# EasyEDA Pro project Cortex-8 (1).epro, board PCB2
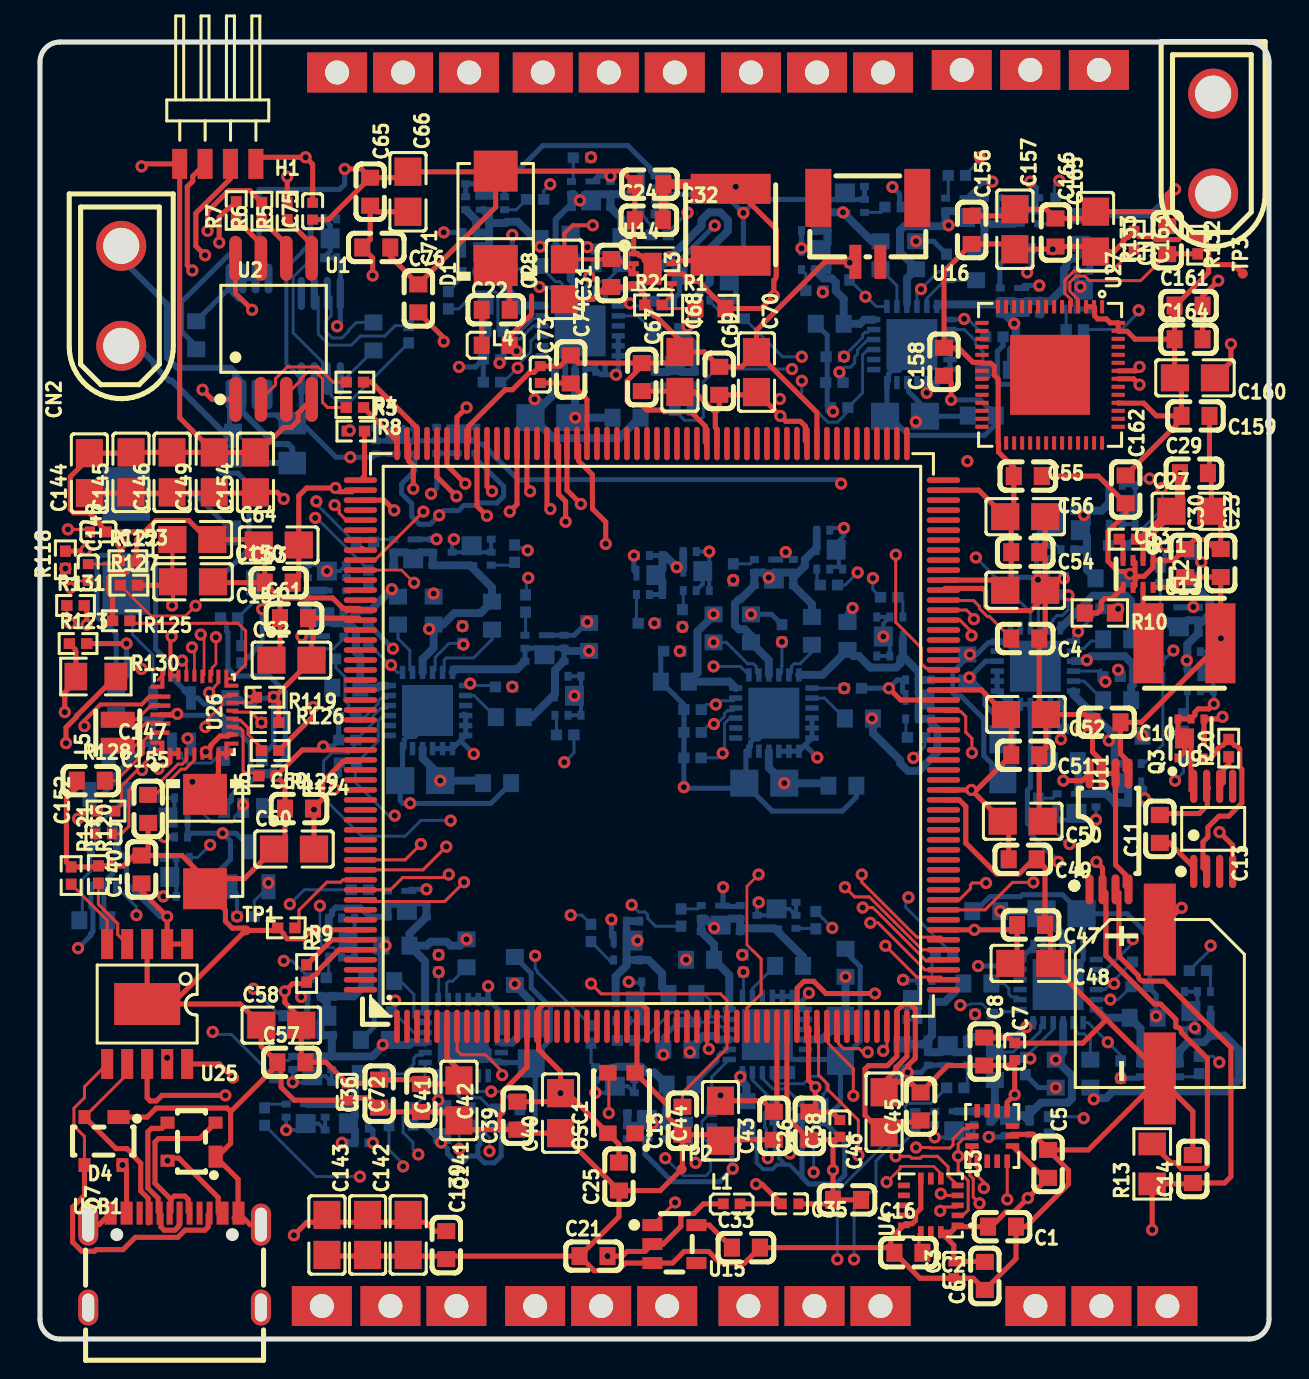
[diagram p0: board, top side]
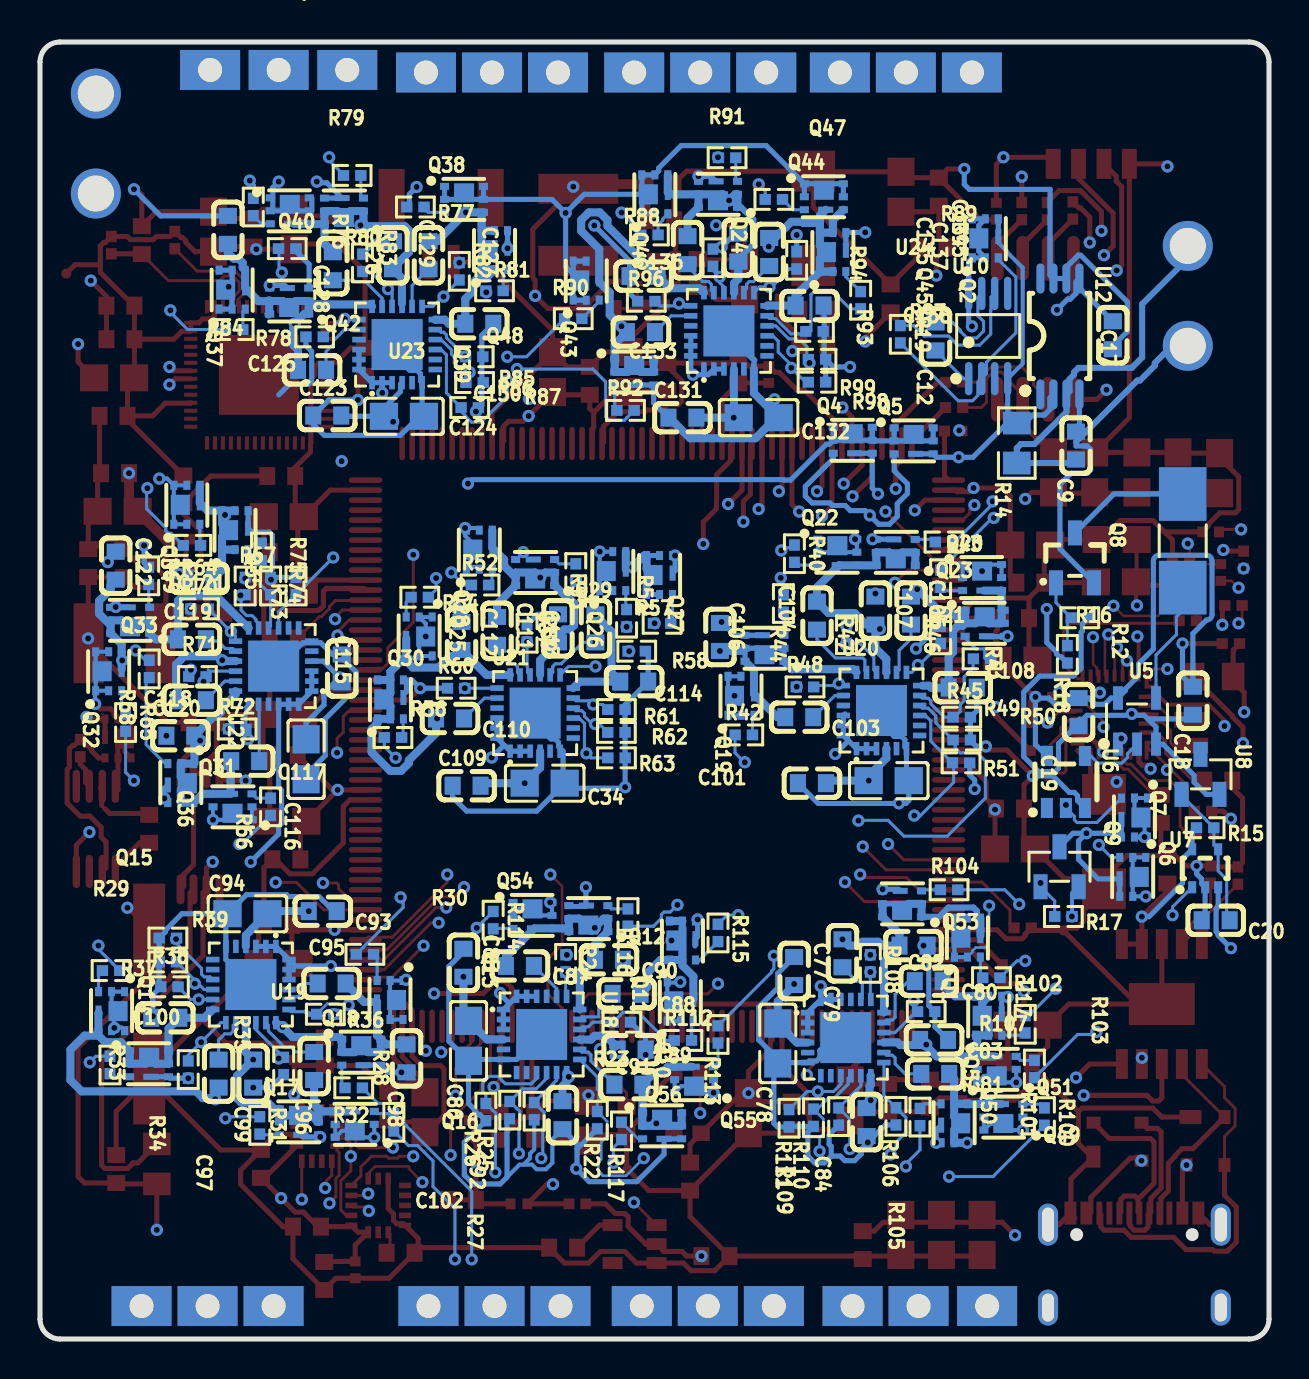
[diagram p1: board, bottom side, seen from below]

Outline 61.47 x 64.9 mm; copper layers: Top Layer, Inner1, Inner2, Inner3, Inner4, Inner5, Inner6, Bottom Layer. Coordinates in mm from the lower left corner of the outline.
Outline path: 0,63.9 0,1 arc(0.29,0.29) 1,0 60.47,0 arc(61.18,0.29) 61.47,1 61.47,63.9 arc(61.18,64.6) 60.47,64.9 1,64.9 arc(0.29,64.6) 0,63.9
Stack: Top Layer 0.035mm Outer layer thickness 1oz / Dielectric1 0.1164mm 2116 RC54% 4.9mil / Inner1 0.0152mm Inner layer thickness / Dielectric2 0.3mm 0.3mm H/HOZ No copper / Inner2 0.0152mm Inner layer thickness / Dielectric3 0.0764mm 1080 RC67% 3.3mil / Dielectric4 0.0764mm 1080 RC67% 3.3mil / Inner3 0.0152mm Inner layer thickness / Dielectric5 0.3mm 0.3mm H/HOZ No copper / Inner4 0.0152mm Inner layer thickness / Dielectric6 0.0764mm 1080 RC67% 3.3mil / Dielectric7 0.0764mm 1080 RC67% 3.3mil / Inner5 0.0152mm Inner layer thickness / Dielectric8 0.3mm 0.3mm H/HOZ No copper / Inner6 0.0152mm Inner layer thickness / Dielectric9 0.1164mm 2116 RC54% 4.9mil / Bottom Layer 0.035mm Outer layer thickness 1oz

## Design rules (mm)
spacing copperThickness1oz (default): track to track 0.102, other pairs 0.152 to 0.3
spacing copperThickness2oz: track to track 0.203, other pairs 0.152 to 0.3
track width copperThickness1oz (default): min 0.127, default 0.254, max 2.54
track width copperThickness2oz: min 0.203, default 0.254, max 2.54
differential pair differentialPair (default): width min 0.127, default 0.254, max 2.54; gap min 0.152, default 0.152
net DGND uses copperRegion

## Placement (name value [footprint] x y rotation side)
C1  100nF  [C0603]  48.11 5.62 180 top
C2  100nF  [C0603]  43.43 4.32 180 top
C3  1uF  [C0402]  45.7 3.46 90 top
C4  2.2uF  [C0603]  49.28 35.05 180 top
C5  100nF  [C0603]  50.42 8.76 270 top
C6  100nF  [C0603]  47.26 3.16 90 top
C7  1uF  [C0402]  48.75 14.38 270 top
C8  100nF  [C0603]  47.23 14.38 270 top
C9  100nF  [C0603]  9.65 44.7 90 bottom
C10  100nF  [C0603]  53.34 30.86 180 top
C11  2.2uF  [C0603]  56.01 25.53 90 top
C12  2.2uF  [C0603]  16.68 50.16 90 bottom
C13  220uF  [CAP-SMD_BD8.0-L8.3-W8.3-LS9.3-FD]  56.01 16.76 270 top
C14  100nF  [C0603]  57.66 8.51 90 top
C15  100nF  [C0603]  32.13 10.92 90 top
C16  100nF  [C0603]  40.36 6.96 180 top
C17  100nF  [C0603]  7.81 50.23 270 bottom
C18  100nF  [C0603]  3.81 31.94 90 bottom
C19  100nF  [C0603]  9.53 31.37 90 bottom
C20  100nF  [C0603]  2.67 20.95 0 bottom
C21  100nF  [C0603]  27.69 4.15 0 top
C22  47uF  [C0603]  22.79 51.5 180 top
C23  100nF  [C0603]  59.05 38.83 270 top
C24  47uF  [C0603]  30.45 55.98 0 top
C25  100nF  [C0603]  28.96 8.13 90 top
C26  100nF  [C0603]  38.48 10.67 90 top
C27  10uF  [C0805]  57.59 41.42 0 top
C28  10uF  [C0805]  26.23 53.02 90 top
C29  100nF  [C0603]  57.71 43.32 0 top
C30  100nF  [C0603]  57.27 38.83 270 top
C31  100nF  [C0603]  28.58 53.34 90 top
C32  100nF  [C0603]  30.48 57.78 180 top
C33  100nF  [C0603]  35.31 4.57 0 top
C34  10uF  [C0805]  36.23 27.81 0 bottom
C35  1uF  [C0402]  37.51 6.76 180 top
C36  1uF  [C0402]  15.36 12.37 90 top
C37  100nF  [C0603]  33.69 35.56 270 bottom
C38  1uF  [C0402]  40.01 10.54 90 top
C39  100nF  [C0603]  23.88 11.18 90 top
C40  10uF  [C0805]  26.04 11.3 90 top
C41  100nF  [C0603]  19.05 12.06 90 top
C42  10uF  [C0805]  20.95 11.94 90 top
C43  100nF  [C0603]  36.7 10.67 90 top
C44  10uF  [C0805]  34.04 10.92 90 top
C45  100nF  [C0603]  44.04 11.63 90 top
C46  10uF  [C0805]  42.22 11.35 90 top
C47  100nF  [C0603]  49.57 20.72 180 top
C48  10uF  [C0805]  49.53 18.8 180 top
C49  100nF  [C0603]  49.15 24 180 top
C50  10uF  [C0805]  49.15 25.91 180 top
C51  100nF  [C0603]  49.28 29.21 180 top
C52  10uF  [C0805]  49.31 31.25 180 top
C53  100nF  [C0603]  49.28 39.37 180 top
C54  10uF  [C0805]  49.28 37.46 180 top
C55  100nF  [C0603]  49.4 43.18 180 top
C56  10uF  [C0805]  49.28 41.15 180 top
C57  100nF  [C0603]  12.57 13.84 0 top
C58  10uF  [C0805]  12.07 15.7 0 top
C59  100nF  [C0603]  12.95 26.54 0 top
C60  10uF  [C0805]  12.7 24.52 0 top
C61  100nF  [C0603]  12.7 36.07 0 top
C62  10uF  [C0805]  12.58 33.97 0 top
C63  100nF  [C0603]  11.94 37.85 0 top
C64  10uF  [C0805]  11.94 39.73 0 top
C65  100nF  [C0603]  16.51 57.41 270 top
C66  10uF  [C0805]  18.4 57.4 270 top
C67  100nF  [C0603]  30.1 48.13 270 top
C68  10uF  [C0805]  32 48.39 270 top
C69  100nF  [C0603]  33.97 47.94 270 top
C70  10uF  [C0805]  35.83 48.38 270 top
C71  2.2uF  [C0603]  18.92 52.07 270 top
C72  100nF  [C0603]  16.96 12.28 90 top
C73  1uF  [C0402]  25.02 48.26 270 top
C74  100nF  [C0603]  26.54 48.51 270 top
C75  1uF  [C0402]  13.64 56.43 90 top
C76  100nF  [C0603]  16.82 54.62 180 top
C77  100nF  [C0603]  23.75 18.41 270 bottom
C78  10uF  [C0805]  24.57 14.79 90 bottom
C79  100nF  [C0603]  21.33 19.3 90 bottom
C80  100nF  [C0603]  17.02 17.91 0 bottom
C81  100nF  [C0603]  16.7 13.27 0 bottom
C82  10nF  [C0603]  17.78 19.68 0 bottom
C83  10nF  [C0603]  16.75 14.97 0 bottom
C84  10nF  [C0603]  20.12 10.86 90 bottom
C85  100nF  [C0603]  40.29 18.83 270 bottom
C86  10uF  [C0805]  40.04 14.92 90 bottom
C87  100nF  [C0603]  37.46 18.67 0 bottom
C88  100nF  [C0603]  32.13 17.27 0 bottom
C89  100nF  [C0603]  32.04 12.73 0 bottom
C90  10nF  [C0603]  33.01 18.98 0 bottom
C91  10nF  [C0603]  31.88 14.48 0 bottom
C92  10nF  [C0603]  35.34 11.2 90 bottom
C93  100nF  [C0603]  47.33 21.41 0 bottom
C94  10uF  [C0805]  51.09 21.28 180 bottom
C95  100nF  [C0603]  46.88 17.79 180 bottom
C96  100nF  [C0603]  47.76 13.66 90 bottom
C97  100nF  [C0603]  52.53 13.28 90 bottom
C98  10nF  [C0603]  43.14 14.04 90 bottom
C99  10nF  [C0603]  50.8 13.28 90 bottom
C100  10nF  [C0603]  55.2 16.07 180 bottom
C101  100nF  [C0603]  22.86 27.81 180 bottom
C102  10uF  [C0805]  19.02 27.94 0 bottom
C103  100nF  [C0603]  23.49 31.11 0 bottom
C104  100nF  [C0603]  22.61 36.19 270 bottom
C105  100nF  [C0603]  17.91 36.45 270 bottom
C106  10nF  [C0603]  27.46 35.13 270 bottom
C107  10nF  [C0603]  19.69 36.45 270 bottom
C108  10nF  [C0603]  15.32 32.59 0 bottom
C109  100nF  [C0603]  40.13 27.69 180 bottom
C110  100nF  [C0603]  40.96 31.05 0 bottom
C111  100nF  [C0603]  38.61 35.43 270 bottom
C112  10nF  [C0603]  40.39 35.18 270 bottom
C113  10nF  [C0603]  35.56 35.56 270 bottom
C114  10nF  [C0603]  31.75 32.89 0 bottom
C115  100nF  [C0603]  46.38 33.55 270 bottom
C116  10uF  [C0805]  48.16 29.01 90 bottom
C117  100nF  [C0603]  51.2 28.92 0 bottom
C118  100nF  [C0603]  53.87 31.96 180 bottom
C119  100nF  [C0603]  53.87 35.01 180 bottom
C120  10nF  [C0603]  54.45 30.19 180 bottom
C121  10nF  [C0603]  53.49 38.06 180 bottom
C122  10nF  [C0603]  57.68 38.69 270 bottom
C123  100nF  [C0603]  47.1 46.21 180 bottom
C124  10uF  [C0805]  43.27 46.17 0 bottom
C125  100nF  [C0603]  47.86 48.49 0 bottom
C126  100nF  [C0603]  46.82 53.68 270 bottom
C127  100nF  [C0603]  42.04 54.23 270 bottom
C128  10nF  [C0603]  52.07 55.5 270 bottom
C129  10nF  [C0603]  43.82 54.23 270 bottom
C130  10nF  [C0603]  39.5 50.8 0 bottom
C131  100nF  [C0603]  29.34 46.1 180 bottom
C132  10uF  [C0805]  25.53 46.1 0 bottom
C133  100nF  [C0603]  31.41 50.38 0 bottom
C134  100nF  [C0603]  29.08 54.48 270 bottom
C135  100nF  [C0603]  25 54.39 270 bottom
C136  10nF  [C0603]  31.28 53.19 180 bottom
C137  10nF  [C0603]  26.54 54.61 270 bottom
C138  10nF  [C0603]  22.98 51.71 0 bottom
C139  100nF  [C0603]  20.32 4.7 270 top
C140  100nF  [C0603]  5.08 23.49 90 top
C141  10uF  [C0805]  18.42 5.21 270 top
C142  10uF  [C0805]  16.38 5.21 270 top
C143  10uF  [C0805]  14.35 5.21 270 top
C144  10uF  [C0805]  2.47 43.33 90 top
C145  10uF  [C0805]  4.55 43.36 90 top
C146  10uF  [C0805]  6.61 43.36 90 top
C147  47nF  [C0402]  3.17 25.27 180 top
C148  47nF  [C0402]  2.41 38.35 270 top
C149  10uF  [C0805]  8.72 43.36 90 top
C150  10uF  [C0805]  7.62 40 180 top
C151  10uF  [C0805]  7.65 37.89 180 top
C152  4.7uF  [C0603]  5.41 26.53 90 top
C153  47nF  [C0402]  2.92 40.39 180 top
C154  10uF  [C0805]  10.78 43.36 90 top
C155  2.2uF  [C0603]  2.54 27.94 180 top
C156  100nF  [C0603]  46.6 55.49 270 top
C157  10uF  [C0805]  48.76 55.53 270 top
C158  100nF  [C0603]  45.21 48.89 90 top
C159  100nF  [C0603]  57.79 46.19 180 top
C160  10uF  [C0805]  57.77 48.09 180 top
C161  100nF  [C0603]  57.44 51.71 0 top
C162  100nF  [C0603]  54.3 42.51 270 top
C163  100nF  [C0603]  56.38 54.99 90 top
C164  100nF  [C0603]  57.44 50.03 0 top
C165  10uF  [C0805]  52.79 55.41 270 top
C166  100nF  [C0603]  50.79 55.37 270 top
CN1  XT30UPB-M  [CONN-TH_XT30UPB-M]  58.67 59.82 90 top
CN2  XT30UPB-M  [CONN-TH_XT30UPB-M]  4.06 52.2 90 top
D1  SMBJ15A  [SMB_L4.6-W3.6-LS5.3-RD]  22.79 56.07 90 top
D4  PRTR5V0U2X  [SOT-143_L2.9-W1.3-P1.92-LS2.3-BL]  3.17 9.91 180 top
D6  SMBJ24A  [SMB_L4.5-W3.7-LS5.4-RD]  8.25 24.89 270 top
D7  PRTR5V0U2X  [SOT-143_L2.9-W1.3-P1.92-LS2.3-BL]  7.58 9.87 90 top
H1  HX PZ1.27-1x4P WT  [HDR-SMD_4P-P1.27-H-M-W7.8]  8.89 58.8 180 top
L1  SCBW100505U100T  [L0402]  34.59 6.76 0 top
L2  2.2uH  [IND-SMD_L4.0-W4.0_LQH44PN2R2MP0L]  57.24 34.81 0 top
L3  2.2uH  [IND-SMD_L4.0-W4.0_LQH44PN2R2MP0L]  34.54 55.75 90 top
L4  4.7uH  [L0603]  22.79 49.72 180 top
L5  1uH  [IND-SMD_L2.0-W1.6_MTQH201610S]  3.89 30.34 90 top
NOREF  -  [Pad_e101]  46.1 63.5 180 top
NOREF#2  -  [Pad_e100]  49.53 63.5 180 top
NOREF#3  -  [Pad_e43]  20.83 1.65 0 top
NOREF#4  -  [Pad_e48]  31.37 1.65 0 top
NOREF#5  -  [Pad_e50]  28.45 63.37 180 top
NOREF#6  -  [Pad_e40]  56.39 1.65 0 top
NOREF#7  -  [Pad_e47]  28.07 1.65 0 top
NOREF#8  -  [Pad_e38]  38.73 1.65 180 top
NOREF#9  -  [Pad_e439]  42.04 1.65 180 top
NOREF#10  -  [Pad_e46]  24.77 1.65 0 top
NOREF#11  -  [Pad_e51]  25.15 63.37 180 top
NOREF#12  -  [Pad_e45]  14.1 1.65 0 top
NOREF#13  -  [Pad_e55]  14.86 63.37 180 top
NOREF#14  -  [Pad_e56]  18.16 63.37 180 top
NOREF#15  -  [Pad_e44]  17.53 1.65 0 top
NOREF#16  -  [Pad_e39]  35.43 1.65 180 top
NOREF#17  -  [Pad_e99]  52.96 63.5 180 top
NOREF#18  -  [Pad_e42]  49.78 1.65 0 top
NOREF#19  -  [Pad_e57]  21.46 63.37 180 top
NOREF#20  -  [Pad_e41]  53.09 1.65 0 top
NOREF#21  -  [Pad_e49]  31.75 63.37 180 top
NOREF#22  -  [Pad_e54]  42.16 63.37 180 top
NOREF#23  -  [Pad_e52]  35.56 63.37 180 top
NOREF#24  -  [Pad_e53]  38.86 63.37 180 top
OSC1  16MHz  [OSC-SMD_4P-L3.2-W2.5_OW2EL89CANUNFAYLC]  29.08 11.81 90 top
Q1  CSD17313Q2  [WSON-6_L2.0-W2.0-P0.65-TL_CSD17313Q2]  15.08 20.09 90 bottom
Q2  CSD17313Q2  [WSON-6_L2.0-W2.0-P0.65-TL_CSD17313Q2]  14.19 55.07 90 bottom
Q3  CSD17313Q2  [WSON-6_L2.0-W2.0-P0.65-TL_CSD17313Q2]  57.57 30.05 90 top
Q4  CSD17313Q2  [WSON-6_L2.0-W2.0-P0.65-TL_CSD17313Q2]  20.82 44.97 180 bottom
Q5  CSD17313Q2  [WSON-6_L2.0-W2.0-P0.65-TL_CSD17313Q2]  17.77 44.94 180 bottom
Q6  CSD17313Q2  [WSON-6_L2.0-W2.0-P0.65-TL_CSD17313Q2]  6.82 23.12 270 bottom
Q7  CSD17313Q2  [WSON-6_L2.0-W2.0-P0.65-TL_CSD17313Q2]  6.73 26.1 270 bottom
Q8  2N7002  [SOT-23-3_L2.9-W1.5-P1.90-LS2.6-BR]  9.7 39.08 270 bottom
Q9  SI2323DS(UMW)  [SOT-23-3_L2.9-W1.3-P0.95-LS2.4-BR]  10.48 23.63 270 bottom
Q10  CSD17313Q2  [WSON-6_L2.0-W2.0-P0.65-TL_CSD17313Q2]  29.44 16.89 90 bottom
Q11  CSD17313Q2  [WSON-6_L2.0-W2.0-P0.65-TL_CSD17313Q2]  29.34 19.94 90 bottom
Q12  CSD17313Q2  [WSON-6_L2.0-W2.0-P0.65-TL_CSD17313Q2]  34.04 21.04 0 bottom
Q13  CSD17313Q2  [WSON-6_L2.0-W2.0-P0.65-TL_CSD17313Q2]  43.96 16.96 270 bottom
Q14  CSD17313Q2  [WSON-6_L2.0-W2.0-P0.65-TL_CSD17313Q2]  57.89 16.4 270 bottom
Q15  CSD17313Q2  [WSON-6_L2.0-W2.0-P0.65-TL_CSD17313Q2]  56.01 13.77 180 bottom
Q16  CSD17313Q2  [WSON-6_L2.0-W2.0-P0.65-TL_CSD17313Q2]  45.72 10.74 0 bottom
Q17  CSD17313Q2  [WSON-6_L2.0-W2.0-P0.65-TL_CSD17313Q2]  48.52 10.87 180 bottom
Q18  CSD17313Q2  [WSON-6_L2.0-W2.0-P0.65-TL_CSD17313Q2]  45.4 14.35 180 bottom
Q19  CSD17313Q2  [WSON-6_L2.0-W2.0-P0.65-TL_CSD17313Q2]  26.41 32.19 90 bottom
Q20  CSD17313Q2  [WSON-6_L2.0-W2.0-P0.65-TL_CSD17313Q2]  14.35 38.1 180 bottom
Q21  CSD17313Q2  [WSON-6_L2.0-W2.0-P0.65-TL_CSD17313Q2]  14.22 35.81 180 bottom
Q22  CSD17313Q2  [WSON-6_L2.0-W2.0-P0.65-TL_CSD17313Q2]  21.59 39.37 180 bottom
Q23  CSD17313Q2  [WSON-6_L2.0-W2.0-P0.65-TL_CSD17313Q2]  18.67 39.36 0 bottom
Q24  CSD17313Q2  [WSON-6_L2.0-W2.0-P0.65-TL_CSD17313Q2]  25.23 34.56 0 bottom
Q25  CSD17313Q2  [WSON-6_L2.0-W2.0-P0.65-TL_CSD17313Q2]  42.5 35.15 270 bottom
Q26  CSD17313Q2  [WSON-6_L2.0-W2.0-P0.65-TL_CSD17313Q2]  32.82 38.42 90 bottom
Q27  CSD17313Q2  [WSON-6_L2.0-W2.0-P0.65-TL_CSD17313Q2]  30.48 38.23 90 bottom
Q28  CSD17313Q2  [WSON-6_L2.0-W2.0-P0.65-TL_CSD17313Q2]  39.5 39.5 90 bottom
Q29  CSD17313Q2  [WSON-6_L2.0-W2.0-P0.65-TL_CSD17313Q2]  36.7 38.35 0 bottom
Q30  CSD17313Q2  [WSON-6_L2.0-W2.0-P0.65-TL_CSD17313Q2]  43.94 32 90 bottom
Q31  CSD17313Q2  [WSON-6_L2.0-W2.0-P0.65-TL_CSD17313Q2]  51.84 26.63 0 bottom
Q32  CSD17313Q2  [WSON-6_L2.0-W2.0-P0.65-TL_CSD17313Q2]  58.03 33.41 90 bottom
Q33  CSD17313Q2  [WSON-6_L2.0-W2.0-P0.65-TL_CSD17313Q2]  56.96 35.96 0 bottom
Q34  CSD17313Q2  [WSON-6_L2.0-W2.0-P0.65-TL_CSD17313Q2]  54.13 41.74 90 bottom
Q35  CSD17313Q2  [WSON-6_L2.0-W2.0-P0.65-TL_CSD17313Q2]  51.71 40.47 90 bottom
Q36  CSD17313Q2  [WSON-6_L2.0-W2.0-P0.65-TL_CSD17313Q2]  54.43 27.82 270 bottom
Q37  CSD17313Q2  [WSON-6_L2.0-W2.0-P0.65-TL_CSD17313Q2]  51.86 52.51 90 bottom
Q38  CSD17313Q2  [WSON-6_L2.0-W2.0-P0.65-TL_CSD17313Q2]  40.26 57.02 180 bottom
Q39  CSD17313Q2  [WSON-6_L2.0-W2.0-P0.65-TL_CSD17313Q2]  38.73 54.48 90 bottom
Q40  CSD17313Q2  [WSON-6_L2.0-W2.0-P0.65-TL_CSD17313Q2]  48.97 56.45 180 bottom
Q41  CSD17313Q2  [WSON-6_L2.0-W2.0-P0.65-TL_CSD17313Q2]  46.27 56.44 0 bottom
Q42  CSD17313Q2  [WSON-6_L2.0-W2.0-P0.65-TL_CSD17313Q2]  49 51.94 0 bottom
Q43  CSD17313Q2  [WSON-6_L2.0-W2.0-P0.65-TL_CSD17313Q2]  34.15 52.96 90 bottom
Q44  CSD17313Q2  [WSON-6_L2.0-W2.0-P0.65-TL_CSD17313Q2]  22.26 57.16 180 bottom
Q45  CSD17313Q2  [WSON-6_L2.0-W2.0-P0.65-TL_CSD17313Q2]  21.81 54.39 90 bottom
Q46  CSD17313Q2  [WSON-6_L2.0-W2.0-P0.65-TL_CSD17313Q2]  30.72 57.28 90 bottom
Q47  CSD17313Q2  [WSON-6_L2.0-W2.0-P0.65-TL_CSD17313Q2]  27.56 57.28 0 bottom
Q48  CSD17313Q2  [WSON-6_L2.0-W2.0-P0.65-TL_CSD17313Q2]  31.75 48.39 180 bottom
Q49  CSD17313Q2  [WSON-6_L2.0-W2.0-P0.65-TL_CSD17313Q2]  13.29 11.11 0 bottom
Q50  CSD17313Q2  [WSON-6_L2.0-W2.0-P0.65-TL_CSD17313Q2]  15.75 10.79 270 bottom
Q51  CSD17313Q2  [WSON-6_L2.0-W2.0-P0.65-TL_CSD17313Q2]  13.62 13.49 0 bottom
Q52  CSD17313Q2  [WSON-6_L2.0-W2.0-P0.65-TL_CSD17313Q2]  14.02 16.18 90 bottom
Q53  CSD17313Q2  [WSON-6_L2.0-W2.0-P0.65-TL_CSD17313Q2]  18.35 21.78 0 bottom
Q54  CSD17313Q2  [WSON-6_L2.0-W2.0-P0.65-TL_CSD17313Q2]  36.84 21.2 180 bottom
Q55  CSD17313Q2  [WSON-6_L2.0-W2.0-P0.65-TL_CSD17313Q2]  28.75 12.98 0 bottom
Q56  CSD17313Q2  [WSON-6_L2.0-W2.0-P0.65-TL_CSD17313Q2]  30.35 10.67 180 bottom
R1  560kΩ  [R0603]  33.53 51.56 0 top
R2  10kΩ  [R0402]  13.33 18.29 270 top
R3  22Ω  [R0402]  15.75 47.88 180 top
R4  22Ω  [R0402]  15.75 46.61 180 top
R5  22Ω  [R0402]  12.37 56.44 90 top
R6  22Ω  [R0402]  11.1 56.43 90 top
R7  22Ω  [R0402]  9.81 56.47 90 top
R8  22Ω  [R0402]  15.8 45.43 180 top
R9  10kΩ  [R0402]  12.32 20.57 180 top
R10  267kΩ  [R0603]  53.01 36.33 180 top
R11  100kΩ  [R0402]  54.41 40.02 180 top
R12  10Ω  [RES-SMD_L5.8-W2.2]  4.32 39.94 90 bottom
R13  10mΩ  [R0805]  55.63 8.76 90 top
R14  10mΩ  [R0805]  12.61 44.83 90 bottom
R15  10kΩ  [R0402]  3.19 25.58 0 bottom
R16  100kΩ  [R0402]  9.46 36.09 0 bottom
R17  100kΩ  [R0402]  10.28 21.14 0 bottom
R18  100Ω  [R0402]  10.08 34.26 90 bottom
R19  100Ω  [R0402]  18.44 50.28 270 bottom
R20  100Ω  [R0402]  59.45 29.57 90 top
R21  100kΩ  [R0402]  30.68 51.74 0 top
R22  10kΩ  [R0402]  33.59 10.95 90 bottom
R23  10kΩ  [R0402]  32.36 15.85 0 bottom
R24  10kΩ  [R0402]  35.18 18.8 270 bottom
R25  10kΩ  [R0402]  36.75 11.4 90 bottom
R26  10kΩ  [R0402]  37.97 11.45 90 bottom
R27  10kΩ  [R0402]  39.17 11.35 90 bottom
R28  2.2Ω  [R0402]  43.77 10.84 90 bottom
R29  2.2Ω  [R0402]  57.91 18.44 180 bottom
R30  2.2Ω  [R0402]  45.22 19.25 180 bottom
R31  2.2Ω  [R0402]  50.48 10.69 270 bottom
R32  2.2Ω  [R0402]  45.78 12.57 180 bottom
R33  2.2Ω  [R0402]  57.97 13.71 270 bottom
R34  10kΩ  [R0402]  54.05 13.48 90 bottom
R35  10kΩ  [R0402]  49.28 13.66 90 bottom
R36  10kΩ  [R0402]  47.2 16.25 0 bottom
R37  10kΩ  [R0402]  55 17.62 180 bottom
R38  10kΩ  [R0402]  55.07 18.87 180 bottom
R39  10kΩ  [R0402]  55.07 20.06 180 bottom
R40  2.2Ω  [R0402]  23.74 39.29 270 bottom
R41  2.2Ω  [R0402]  16.42 38.04 90 bottom
R42  2.2Ω  [R0402]  26.27 30.23 180 bottom
R43  2.2Ω  [R0402]  16.26 39.88 0 bottom
R44  2.2Ω  [R0402]  24.29 36.8 90 bottom
R45  2.2Ω  [R0402]  14.35 34.04 180 bottom
R46  10kΩ  [R0402]  16.42 35.23 270 bottom
R47  10kΩ  [R0402]  21.13 35.24 270 bottom
R48  10kΩ  [R0402]  23.21 32.63 180 bottom
R49  10kΩ  [R0402]  15.37 31.11 0 bottom
R50  10kΩ  [R0402]  15.37 29.97 0 bottom
R51  10kΩ  [R0402]  15.4 28.83 0 bottom
R52  2.2Ω  [R0402]  39.46 37.73 180 bottom
R53  2.2Ω  [R0402]  32.13 36.07 270 bottom
R54  2.2Ω  [R0402]  42.47 37.12 0 bottom
R55  2.2Ω  [R0402]  34.67 38.35 90 bottom
R56  2.2Ω  [R0402]  43.82 30.1 0 bottom
R57  2.2Ω  [R0402]  30.35 35.81 180 bottom
R58  10kΩ  [R0402]  31.62 34.42 0 bottom
R59  10kΩ  [R0402]  37.11 35.31 270 bottom
R60  10kΩ  [R0402]  40.65 32.56 180 bottom
R61  10kΩ  [R0402]  32.64 31.5 0 bottom
R62  10kΩ  [R0402]  32.64 30.35 0 bottom
R63  10kΩ  [R0402]  32.64 29.08 0 bottom
R64  2.2Ω  [R0402]  53.87 39.71 180 bottom
R65  2.2Ω  [R0402]  57.19 30.85 270 bottom
R66  2.2Ω  [R0402]  49.94 26.63 90 bottom
R67  2.2Ω  [R0402]  50.39 39.38 90 bottom
R68  2.2Ω  [R0402]  56.01 33.53 90 bottom
R69  2.2Ω  [R0402]  56.03 38.19 270 bottom
R70  10kΩ  [R0402]  53.49 36.54 180 bottom
R71  10kΩ  [R0402]  53.59 33.15 180 bottom
R72  10kΩ  [R0402]  51.61 30.53 180 bottom
R73  10kΩ  [R0402]  51.2 37.68 270 bottom
R74  10kΩ  [R0402]  49.94 37.68 270 bottom
R75  10kΩ  [R0402]  48.67 37.68 270 bottom
R76  2.2Ω  [R0402]  50.8 56.64 270 bottom
R77  2.2Ω  [R0402]  42.69 56.64 0 bottom
R78  2.2Ω  [R0402]  51.76 50.51 180 bottom
R79  2.2Ω  [R0402]  45.86 58.22 180 bottom
R80  2.2Ω  [R0402]  49.1 54.56 0 bottom
R81  2.2Ω  [R0402]  38.73 52.45 180 bottom
R82  10kΩ  [R0402]  40.49 53.42 270 bottom
R83  10kΩ  [R0402]  45.34 53.85 270 bottom
R84  10kΩ  [R0402]  47.73 50.15 180 bottom
R85  10kΩ  [R0402]  39.75 49.15 0 bottom
R86  10kΩ  [R0402]  39.73 47.86 0 bottom
R87  10kΩ  [R0402]  39.98 46.61 0 bottom
R88  2.2Ω  [R0402]  30.99 55.24 180 bottom
R89  2.2Ω  [R0402]  24.77 57.02 0 bottom
R90  2.2Ω  [R0402]  34.8 51.05 180 bottom
R91  2.2Ω  [R0402]  27.1 59.11 180 bottom
R92  2.2Ω  [R0402]  32.18 46.47 180 bottom
R93  2.2Ω  [R0402]  20.42 51.98 90 bottom
R94  10kΩ  [R0402]  23.62 53.97 270 bottom
R95  10kΩ  [R0402]  27.81 54.1 270 bottom
R96  10kΩ  [R0402]  31.14 51.93 180 bottom
R97  10kΩ  [R0402]  22.73 50.42 0 bottom
R98  10kΩ  [R0402]  22.61 49.02 0 bottom
R99  10kΩ  [R0402]  22.61 47.88 0 bottom
R100  2.2Ω  [R0402]  11.23 11.13 270 bottom
R101  2.2Ω  [R0402]  11.73 13.51 90 bottom
R102  2.2Ω  [R0402]  13.88 18.08 0 bottom
R103  2.2Ω  [R0402]  12.19 15.75 270 bottom
R104  2.2Ω  [R0402]  16 22.48 180 bottom
R105  2.2Ω  [R0402]  17.46 11.11 90 bottom
R106  10kΩ  [R0402]  18.66 11.14 90 bottom
R107  10kΩ  [R0402]  17.14 16.38 0 bottom
R108  10kΩ  [R0402]  19.94 18.8 270 bottom
R109  10kΩ  [R0402]  21.52 11.13 90 bottom
R110  10kΩ  [R0402]  22.78 11.07 90 bottom
R111  10kΩ  [R0402]  24 11.05 90 bottom
R112  2.2Ω  [R0402]  29.32 14.94 180 bottom
R113  2.2Ω  [R0402]  27.56 15.24 90 bottom
R114  2.2Ω  [R0402]  38.8 20.96 270 bottom
R115  2.2Ω  [R0402]  27.56 20.32 270 bottom
R116  2.2Ω  [R0402]  32.06 21.09 270 bottom
R117  2.2Ω  [R0402]  32.39 10.41 90 bottom
R118  10kΩ  [R0402]  1.27 38.99 90 top
R119  10kΩ  [R0402]  11.25 32.11 180 top
R120  15kΩ  [R0402]  2.92 23.24 270 top
R121  15kΩ  [R0402]  1.56 23.19 270 top
R122  6.04kΩ  [R0402]  4.4 38.94 0 top
R123  10kΩ  [R0402]  1.91 34.8 0 top
R124  10kΩ  [R0402]  11.51 29.45 180 top
R125  100kΩ  [R0402]  4.06 35.94 180 top
R126  100kΩ  [R0402]  11.51 30.84 180 top
R127  100Ω  [R0402]  4.45 37.72 0 top
R128  2.2kΩ  [R0402]  3.3 26.42 0 top
R129  294Ω  [R0402]  11.38 28.18 180 top
R130  127kΩ  [R0805]  2.79 33.15 0 top
R131  100kΩ  [R0402]  1.78 36.7 0 top
R132  10kΩ  [R0402]  57.9 54.73 90 top
R133  10kΩ  [R0402]  54.72 54.99 90 top
TP1  -  [Test-Point-0.5mm]  10.29 20.45 0 top
TP2  -  [Test-Point-0.5mm]  32.09 8.5 0 top
TP3  -  [Test-Point-0.5mm]  60.15 53.31 270 top
U1  STM32H743BIT6  [LQFP-208_L28.0-W28.0-P0.50-LS30.0-BL]  30.61 30.23 0 top
U2  W25Q128JWSIQ  [SOIC-8_L5.3-W5.3-P1.27-LS8.0-BL]  11.68 50.55 0 top
U3  ICM-42688-P  [LGA-14_L3.0-W2.5-P0.50-TL]  47.63 10.16 90 top
U4  ICM-20602  [LGA-16_L3.0-W3.0-P0.50-BL]  44.55 6.69 90 top
U5  74LVC1G08GV  [SOT-23-5_L3.0-W1.7-P0.95-LS2.8-BL]  6.6 30.92 180 bottom
U6  74LVC1G04GV  [SOT-23-5_L2.9-W1.6-P0.95-LS2.7-BR]  10.16 27.87 270 bottom
U7  TLV3201AIDCKT  [SOT-353_L2.0-W1.2-P0.65-LS2.1-BL-1]  3.19 23.55 180 bottom
U8  LM4040C25FTA  [SOT-23-3_L2.9-W1.3-P1.90-LS2.4-BR]  3.43 28.25 270 bottom
U9  LM74610QDGKRQ1  [VSSOP-8_L3.0-W3.0-P0.65-LS5.0-BL]  58.67 25.53 0 top
U10  LM74610QDGKRQ1  [VSSOP-8_L3.0-W3.0-P0.65-LS5.0-BL]  14.05 50.19 180 bottom
U11  INA240A2PW  [TSSOP-8_L4.4-W3.0-P0.65-LS6.4-BR]  53.47 25.4 270 top
U12  INA240A2PW  [TSSOP-8_L4.4-W3.0-P0.65-LS6.4-BR]  10.46 50.16 270 bottom
U13  TPS62840DLCR  [VSON-8_L2.0-W1.5-P0.50-BL]  54.92 38.28 180 top
U14  TPS62170QDSGTQ1  [WSON-8_L2.0-W2.0-P0.50-TL-EP]  30.64 53.55 0 top
U15  TPS3840PL33DBVR  [SOT-23-5_L2.9-W1.6-P0.95-LS2.8-BR]  31.73 4.75 180 top
U16  SM02B-GHS-TB(LF)(SN)  [CONN-SMD_SM02B-GHS-TB-LF-SN]  41.4 55.5 180 top
U17  FD6288Q  [QFN-24_L4.0-W4.0-P0.50-BL-EP2.6]  21.17 15.08 270 bottom
U18  FD6288Q  [QFN-24_L4.0-W4.0-P0.50-BL-EP2.6]  36.38 15.24 270 bottom
U19  FD6288Q  [QFN-24_L4.0-W4.0-P0.50-BL-EP2.6]  50.92 17.74 0 bottom
U20  FD6288Q  [QFN-24_L4.0-W4.0-P0.50-BL-EP2.6]  19.38 31.45 180 bottom
U21  FD6288Q  [QFN-24_L4.0-W4.0-P0.50-BL-EP2.6]  36.7 31.32 180 bottom
U22  FD6288Q  [QFN-24_L4.0-W4.0-P0.50-BL-EP2.6]  49.78 33.67 90 bottom
U23  FD6288Q  [QFN-24_L4.0-W4.0-P0.50-BL-EP2.6]  43.61 49.76 180 bottom
U24  FD6288Q  [QFN-24_L4.0-W4.0-P0.50-BL-EP2.6]  27.01 50.45 180 bottom
U25  CH224K  [ESSOP-10_L4.9-W3.9-P1.0-LS6.0-TL-EP]  5.36 16.76 180 top
U26  BQ25798RQMR  [QFN-29_L4.0-W4.0-P0.40-TL-BQ25792RQMR]  7.75 31.24 90 top
U27  ESP32-S3FN8  [QFN-56_L7.0-W7.0-P0.40-TL-EP4.0]  50.52 48.24 270 top
USB1  TYPE-C 16PIN 3MD(385)  [USB-C-SMD_TYPE-C16PIN]  6.73 3.94 0 top

## Footprints (pads in the part's own frame, mm; a bottom-side part is the same pattern mirrored in y, then rotated)
C0402
  rect 0.5x0.54 smd: 1(-0.42,0) 2(0.42,0)
C0603
  rect 0.8x0.9 smd: 1(-0.7,0) 2(0.7,0)
C0805
  rect 1.41x1.35 smd: 1(-1,0) 2(1,0)
CAP-SMD_BD8.0-L8.3-W8.3-LS9.3-FD
  rect 4.6x1.6 smd: 1(-3.724,0) 2(3.724,0)
CONN-SMD_SM02B-GHS-TB-LF-SN
  rect 0.6x1.7 smd: 1(-0.625,1.6) 2(0.625,1.6)
  rect 1.3x2.9 smd: 3(2.475,-1.6) 4(-2.475,-1.6)
CONN-TH_XT30UPB-M
  round 2.5 hole 1.8: 1(-2.5,0) 2(2.5,0)
ESSOP-10_L4.9-W3.9-P1.0-LS6.0-TL-EP
  rect 0.6x1.5 smd: 1(-2,-3) 2(-1,-3) 3(0,-3) 4(1,-3) 5(2,-3) 6(2,3) 7(1,3) 8(0,3) 9(-1,3) 10(-2,3)
  rect 3.3x2.1 smd: 11(0,0)
HDR-SMD_4P-P1.27-H-M-W7.8
  rect 0.75x1.5 smd: 1(-1.905,0) 2(-0.635,0) 3(0.635,0) 4(1.905,0)
IND-SMD_L2.0-W1.6_MTQH201610S
  rect 0.8x1.7 smd: 1(-0.65,0) 2(0.65,0)
IND-SMD_L4.0-W4.0_LQH44PN2R2MP0L
  rect 1.5x4 smd: 1(-1.8,0) 2(1.8,0)
L0402
  rect 0.54x0.54 smd: 1(-0.42,0) 2(0.42,0)
L0603
  rect 0.8x0.864 smd: 1(-0.7,0) 2(0.7,0)
LGA-14_L3.0-W2.5-P0.50-TL
  rect 0.675x0.28 smd: 1(-1.262,0.75) 2(-1.262,0.25) 3(-1.262,-0.25) 4(-1.262,-0.75) 8(1.262,-0.75) 9(1.262,-0.25) 10(1.262,0.25) 11(1.262,0.75)
  rect 0.28x0.675 smd: 5(-0.5,-1.012) 6(0,-1.012) 7(0.5,-1.012) 12(0.5,1.012) 13(0,1.012) 14(-0.5,1.012)
LGA-16_L3.0-W3.0-P0.50-BL
  rect 0.28x0.6 smd: 1(-1,-1.343) 2(-0.5,-1.343) 3(0,-1.343) 4(0.5,-1.343) 5(1,-1.343) 9(1,1.343) 10(0.5,1.343) 11(0,1.343) 12(-0.5,1.343) 13(-1,1.343)
  rect 0.6x0.28 smd: 6(1.343,-0.5) 7(1.343,0) 8(1.343,0.5) 14(-1.343,0.5) 15(-1.343,0) 16(-1.343,-0.5)
LQFP-208_L28.0-W28.0-P0.50-LS30.0-BL
  oval 0.28x1.67 smd: 1(-12.75,-14.58) 2(-12.25,-14.58) 3(-11.75,-14.58) 4(-11.25,-14.58) 5(-10.75,-14.58) 6(-10.25,-14.58) 7(-9.75,-14.58) 8(-9.25,-14.58) 9(-8.75,-14.58) 10(-8.25,-14.58) 11(-7.75,-14.58) 12(-7.25,-14.58) 13(-6.75,-14.58) 14(-6.25,-14.58) 15(-5.75,-14.58) 16(-5.25,-14.58) 17(-4.75,-14.58) 18(-4.25,-14.58) 19(-3.75,-14.58) 20(-3.25,-14.58) 21(-2.75,-14.58) 22(-2.25,-14.58) 23(-1.75,-14.58) 24(-1.25,-14.58) 25(-0.75,-14.58) 26(-0.25,-14.58) 27(0.25,-14.58) 28(0.75,-14.58) 29(1.25,-14.58) 30(1.75,-14.58) 31(2.25,-14.58) 32(2.75,-14.58) 33(3.25,-14.58) 34(3.75,-14.58) 35(4.25,-14.58) 36(4.75,-14.58) 37(5.25,-14.58) 38(5.75,-14.58) 39(6.25,-14.58) 40(6.75,-14.58) 41(7.25,-14.58) 42(7.75,-14.58) 43(8.25,-14.58) 44(8.75,-14.58) 45(9.25,-14.58) 46(9.75,-14.58) 47(10.25,-14.58) 48(10.75,-14.58) 49(11.25,-14.58) 50(11.75,-14.58) 51(12.25,-14.58) 52(12.75,-14.58) 105(12.75,14.58) 106(12.25,14.58) 107(11.75,14.58) 108(11.25,14.58) 109(10.75,14.58) 110(10.25,14.58) 111(9.75,14.58) 112(9.25,14.58) 113(8.75,14.58) 114(8.25,14.58) 115(7.75,14.58) 116(7.25,14.58) 117(6.75,14.58) 118(6.25,14.58) 119(5.75,14.58) 120(5.25,14.58) 121(4.75,14.58) 122(4.25,14.58) 123(3.75,14.58) 124(3.25,14.58) 125(2.75,14.58) 126(2.25,14.58) 127(1.75,14.58) 128(1.25,14.58) 129(0.75,14.58) 130(0.25,14.58) 131(-0.25,14.58) 132(-0.75,14.58) 133(-1.25,14.58) 134(-1.75,14.58) 135(-2.25,14.58) 136(-2.75,14.58) 137(-3.25,14.58) 138(-3.75,14.58) 139(-4.25,14.58) 140(-4.75,14.58) 141(-5.25,14.58) 142(-5.75,14.58) 143(-6.25,14.58) 144(-6.75,14.58) 145(-7.25,14.58) 146(-7.75,14.58) 147(-8.25,14.58) 148(-8.75,14.58) 149(-9.25,14.58) 150(-9.75,14.58) 151(-10.25,14.58) 152(-10.75,14.58) 153(-11.25,14.58) 154(-11.75,14.58) 155(-12.25,14.58) 156(-12.75,14.58)
  oval 1.67x0.28 smd: 53(14.58,-12.75) 54(14.58,-12.25) 55(14.58,-11.75) 56(14.58,-11.25) 57(14.58,-10.75) 58(14.58,-10.25) 59(14.58,-9.75) 60(14.58,-9.25) 61(14.58,-8.75) 62(14.58,-8.25) 63(14.58,-7.75) 64(14.58,-7.25) 65(14.58,-6.75) 66(14.58,-6.25) 67(14.58,-5.75) 68(14.58,-5.25) 69(14.58,-4.75) 70(14.58,-4.25) 71(14.58,-3.75) 72(14.58,-3.25) 73(14.58,-2.75) 74(14.58,-2.25) 75(14.58,-1.75) 76(14.58,-1.25) 77(14.58,-0.75) 78(14.58,-0.25) 79(14.58,0.25) 80(14.58,0.75) 81(14.58,1.25) 82(14.58,1.75) 83(14.58,2.25) 84(14.58,2.75) 85(14.58,3.25) 86(14.58,3.75) 87(14.58,4.25) 88(14.58,4.75) 89(14.58,5.25) 90(14.58,5.75) 91(14.58,6.25) 92(14.58,6.75) 93(14.58,7.25) 94(14.58,7.75) 95(14.58,8.25) 96(14.58,8.75) 97(14.58,9.25) 98(14.58,9.75) 99(14.58,10.25) 100(14.58,10.75) 101(14.58,11.25) 102(14.58,11.75) 103(14.58,12.25) 104(14.58,12.75) 157(-14.58,12.75) 158(-14.58,12.25) 159(-14.58,11.75) 160(-14.58,11.25) 161(-14.58,10.75) 162(-14.58,10.25) 163(-14.58,9.75) 164(-14.58,9.25) 165(-14.58,8.75) 166(-14.58,8.25) 167(-14.58,7.75) 168(-14.58,7.25) 169(-14.58,6.75) 170(-14.58,6.25) 171(-14.58,5.75) 172(-14.58,5.25) 173(-14.58,4.75) 174(-14.58,4.25) 175(-14.58,3.75) 176(-14.58,3.25) 177(-14.58,2.75) 178(-14.58,2.25) 179(-14.58,1.75) 180(-14.58,1.25) 181(-14.58,0.75) 182(-14.58,0.25) 183(-14.58,-0.25) 184(-14.58,-0.75) 185(-14.58,-1.25) 186(-14.58,-1.75) 187(-14.58,-2.25) 188(-14.58,-2.75) 189(-14.58,-3.25) 190(-14.58,-3.75) 191(-14.58,-4.25) 192(-14.58,-4.75) 193(-14.58,-5.25) 194(-14.58,-5.75) 195(-14.58,-6.25) 196(-14.58,-6.75) 197(-14.58,-7.25) 198(-14.58,-7.75) 199(-14.58,-8.25) 200(-14.58,-8.75) 201(-14.58,-9.25) 202(-14.58,-9.75) 203(-14.58,-10.25) 204(-14.58,-10.75) 205(-14.58,-11.25) 206(-14.58,-11.75) 207(-14.58,-12.25) 208(-14.58,-12.75)
OSC-SMD_4P-L3.2-W2.5_OW2EL89CANUNFAYLC
  rect 0.78x0.87 smd: 1(-1.515,-0.68) 2(1.515,-0.68) 3(1.515,0.68) 4(-1.515,0.68)
Pad_e38
  rect 3x2 hole 1.2: 2(0,0)
Pad_e39
  rect 3x2 hole 1.2: 1(0,0)
Pad_e40
  rect 3x2 hole 1.2: 8(0,0)
Pad_e41
  rect 3x2 hole 1.2: 7(0,0)
Pad_e42
  rect 3x2 hole 1.2: 6(0,0)
Pad_e43
  rect 3x2 hole 1.2: 2(0,0)
Pad_e44
  rect 3x2 hole 1.2: 1(0,0)
Pad_e45
  rect 3x2 hole 1.2: 1(0,0)
Pad_e46
  rect 3x2 hole 1.2: 3(0,0)
Pad_e47
  rect 3x2 hole 1.2: 4(0,0)
Pad_e48
  rect 3x2 hole 1.2: 5(0,0)
Pad_e49
  rect 3x2 hole 1.2: 1(0,0)
Pad_e50
  rect 3x2 hole 1.2: 2(0,0)
Pad_e51
  rect 3x2 hole 1.2: 3(0,0)
Pad_e52
  rect 3x2 hole 1.2: 1(0,0)
Pad_e53
  rect 3x2 hole 1.2: 2(0,0)
Pad_e54
  rect 3x2 hole 1.2: 3(0,0)
Pad_e55
  rect 3x2 hole 1.2: 1(0,0)
Pad_e56
  rect 3x2 hole 1.2: 2(0,0)
Pad_e57
  rect 3x2 hole 1.2: 3(0,0)
Pad_e99
  rect 3x2 hole 1.2: 1(0,0)
Pad_e100
  rect 3x2 hole 1.2: 2(0,0)
Pad_e101
  rect 3x2 hole 1.2: 3(0,0)
Pad_e439
  rect 3x2 hole 1.2: 3(0,0)
QFN-24_L4.0-W4.0-P0.50-BL-EP2.6
  rect 0.28x0.665 smd: 1(-1.25,-1.907) 2(-0.75,-1.907) 3(-0.25,-1.907) 4(0.25,-1.907) 5(0.75,-1.907) 6(1.25,-1.907) 13(1.25,1.907) 14(0.75,1.907) 15(0.25,1.907) 16(-0.25,1.907) 17(-0.75,1.907) 18(-1.25,1.907)
  rect 0.665x0.28 smd: 7(1.907,-1.25) 8(1.907,-0.75) 9(1.907,-0.25) 10(1.907,0.25) 11(1.907,0.75) 12(1.907,1.25) 19(-1.907,1.25) 20(-1.907,0.75) 21(-1.907,0.25) 22(-1.907,-0.25) 23(-1.907,-0.75) 24(-1.907,-1.25)
  rect 2.55x2.55 smd: 25(0,0)
QFN-29_L4.0-W4.0-P0.40-TL-BQ25792RQMR
  custom 0.95x0.7 smd: 1(-1.775,1.875) 24(1.775,1.875)
  rect 0.6x0.2 smd: 2(-1.95,1.224) 3(-1.95,0.825) 4(-1.95,0.424) 5(-1.95,0.025) 6(-1.95,-0.376) 7(-1.95,-0.775) 8(-1.95,-1.175) 20(1.95,0.025) 21(1.95,0.424) 22(1.95,0.825) 23(1.95,1.224)
  custom 0.9x0.7 smd: 9(-1.8,-1.825) 16(1.8,-1.825)
  rect 0.2x0.6 smd: 10(-1,-1.875) 11(-0.6,-1.875) 12(-0.2,-1.875) 13(0.2,-1.875) 14(0.6,-1.875) 15(1,-1.875)
  rect 0.7x0.2 smd: 17(1.9,-1.175)
  rect 0.65x0.2 smd: 18(1.925,-0.775)
  rect 0.68x0.2 smd: 19(1.91,-0.376)
  rect 0.22x1 smd: 25(0.9,1.725) 26(0.45,1.725) 27(0,1.725) 28(-0.45,1.725)
  rect 0.22x0.95 smd: 29(-0.9,1.75)
QFN-56_L7.0-W7.0-P0.40-TL-EP4.0
  rect 0.665x0.2 smd: 1(-3.408,2.6) 2(-3.408,2.2) 3(-3.408,1.8) 4(-3.408,1.4) 5(-3.408,1) 6(-3.408,0.6) 7(-3.408,0.2) 8(-3.408,-0.2) 9(-3.408,-0.6) 10(-3.408,-1) 11(-3.408,-1.4) 12(-3.408,-1.8) 13(-3.408,-2.2) 14(-3.408,-2.6) 29(3.408,-2.6) 30(3.408,-2.2) 31(3.408,-1.8) 32(3.408,-1.4) 33(3.408,-1) 34(3.408,-0.6) 35(3.408,-0.2) 36(3.408,0.2) 37(3.408,0.6) 38(3.408,1) 39(3.408,1.4) 40(3.408,1.8) 41(3.408,2.2) 42(3.408,2.6)
  rect 0.2x0.665 smd: 15(-2.6,-3.408) 16(-2.2,-3.408) 17(-1.8,-3.408) 18(-1.4,-3.408) 19(-1,-3.408) 20(-0.6,-3.408) 21(-0.2,-3.408) 22(0.2,-3.408) 23(0.6,-3.408) 24(1,-3.408) 25(1.4,-3.408) 26(1.8,-3.408) 27(2.2,-3.408) 28(2.6,-3.408) 43(2.6,3.408) 44(2.2,3.408) 45(1.8,3.408) 46(1.4,3.408) 47(1,3.408) 48(0.6,3.408) 49(0.2,3.408) 50(-0.2,3.408) 51(-0.6,3.408) 52(-1,3.408) 53(-1.4,3.408) 54(-1.8,3.408) 55(-2.2,3.408) 56(-2.6,3.408)
  rect 4x4 smd: 57(0,0)
R0402
  rect 0.566x0.54 smd: 1(-0.433,0) 2(0.433,0)
R0603
  rect 0.806x0.864 smd: 1(-0.753,0) 2(0.753,0)
R0805
  rect 1.133x1.377 smd: 1(-1,0) 2(1,0)
RES-SMD_L5.8-W2.2
  rect 2.685x2.376 smd: 1(-2.342,0) 2(2.342,0)
SMB_L4.5-W3.7-LS5.4-RD
  rect 2.047x2.192 smd: 1(-2.361,0) 2(2.361,0)
SMB_L4.6-W3.6-LS5.3-RD
  rect 2.047x2.192 smd: 1(-2.361,0) 2(2.361,0)
SOIC-8_L5.3-W5.3-P1.27-LS8.0-BL
  oval 0.63x2.25 smd: 1(-1.905,-3.53) 2(-0.635,-3.53) 3(0.635,-3.53) 4(1.905,-3.53) 5(1.905,3.53) 6(0.635,3.53) 7(-0.635,3.53) 8(-1.905,3.53)
SOT-23-3_L2.9-W1.3-P0.95-LS2.4-BR
  rect 1.25x0.7 smd: 1(1,-0.95) 2(1,0.95) 3(-1,0)
SOT-23-3_L2.9-W1.3-P1.90-LS2.4-BR
  rect 1.25x0.7 smd: 1(1,-0.95) 2(1,0.95) 3(-1,0)
SOT-23-3_L2.9-W1.5-P1.90-LS2.6-BR
  rect 1.25x0.7 smd: 1(1.25,-0.95) 2(1.25,0.95) 3(-1.25,0)
SOT-23-5_L2.9-W1.6-P0.95-LS2.7-BR
  rect 1x0.6 smd: 1(1.3,-0.95) 2(1.3,0) 3(1.3,0.95) 4(-1.3,0.95) 5(-1.3,-0.95)
SOT-23-5_L2.9-W1.6-P0.95-LS2.8-BR
  rect 1x0.6 smd: 1(1.1,-0.95) 2(1.1,0) 3(1.1,0.95) 4(-1.1,0.95) 5(-1.1,-0.95)
SOT-23-5_L3.0-W1.7-P0.95-LS2.8-BL
  rect 0.49x1.157 smd: 1(-0.95,-1.153) 2(0,-1.153) 3(0.95,-1.153)
  rect 0.49x1.175 smd: 4(0.95,1.153) 5(-0.95,1.153)
SOT-143_L2.9-W1.3-P1.92-LS2.3-BL
  rect 1.1x0.7 smd: 1(-0.75,-1.2)
  rect 0.6x0.7 smd: 2(0.95,-1.2) 3(0.95,1.2) 4(-0.95,1.2)
SOT-353_L2.0-W1.2-P0.65-LS2.1-BL-1
  rect 0.4x0.6 smd: 1(-0.65,-0.95) 2(0,-0.95) 3(0.65,-0.95) 4(0.65,0.95) 5(-0.65,0.95)
Test-Point-0.5mm
  round 0.5 smd: 1(0,0)
TSSOP-8_L4.4-W3.0-P0.65-LS6.4-BR
  oval 1.5x0.4 smd: 1(2.9,-0.976) 2(2.9,-0.325) 3(2.9,0.325) 4(2.9,0.976) 5(-2.9,0.976) 6(-2.9,0.325) 7(-2.9,-0.325) 8(-2.9,-0.976)
USB-C-SMD_TYPE-C16PIN
  oval 1x2.1 hole 0.6x1.7: 1(-4.32,1.788) 2(4.32,1.788)
  oval 1x1.8 hole 0.6x1.4: 3(-4.32,-2.362) 4(4.32,-2.362)
  rect 0.6x1.15 smd: A1B12(-3.2,2.362) A4B9(-2.4,2.362) B1A12(3.2,2.362) B4A9(2.4,2.362)
  rect 0.3x1.15 smd: A5(-1.25,2.362) A6(-0.25,2.362) A7(0.25,2.362) A8(1.25,2.362) B5(1.75,2.362) B6(0.75,2.362) B7(-0.75,2.362) B8(-1.75,2.362)
VSON-8_L2.0-W1.5-P0.50-BL
  rect 0.25x0.55 smd: 1(-0.75,-0.675) 2(-0.25,-0.675) 3(0.25,-0.675) 4(0.75,-0.675) 5(0.75,0.675) 6(0.25,0.675) 7(-0.25,0.675) 8(-0.75,0.675)
VSSOP-8_L3.0-W3.0-P0.65-LS5.0-BL
  oval 0.364x1.662 smd: 1(-0.975,-2.131) 2(-0.325,-2.131) 3(0.325,-2.131) 4(0.975,-2.131) 5(0.975,2.131) 6(0.325,2.131) 7(-0.325,2.131) 8(-0.975,2.131)
WSON-6_L2.0-W2.0-P0.65-TL_CSD17313Q2
  rect 0.45x0.35 smd: 1(-0.975,0.65) 2(-0.975,0) 3(-0.975,-0.65) 4(0.975,-0.65) 5(0.975,0.001) 6(0.975,0.65)
  rect 0.75x0.3 smd: 7(0.095,-0.65)
  rect 1x0.95 smd: 8(0,0.325)
WSON-8_L2.0-W2.0-P0.50-TL-EP
  rect 0.521x0.25 smd: 1(-0.95,0.75) 2(-0.95,0.25) 3(-0.95,-0.25) 4(-0.95,-0.75) 5(0.95,-0.75) 6(0.95,-0.25) 7(0.95,0.25) 8(0.95,0.75)
  rect 0.9x1.6 smd: 9(0,0)

## Nets
20V_PD: C139.1 C141.1 C142.1 C143.1 D6.1 U25.8 U26.2 U26.3 U26.8 U26.9
AGND: C16.1 C16.2 C26.1 C35.1 C38.1 C161.2 C164.2 U1.40
DGND: C1.1 C2.2 C3.1 C4.1 C5.1 C6.1 C7.1 C8.1 C9.2 C10.2 C13.2 C14.2 C15.1 C17.2 C18.1 C19.1 C20.2 C21.1 C23.1 C24.1 C25.1 C27.2 C28.1 C29.2 C30.1 C31.1 C32.2 C33.2 C34.1 C36.1 C39.1 C40.1 C41.1 C42.1 C43.1 C44.1 C45.1 C46.1 C47.1 C48.1 C49.1 C50.1 C51.1 C52.1 C53.1 C54.1 C55.1 C56.1 C57.1 C58.1 C59.1 C60.1 C61.1 C62.1 C63.1 C64.1 C65.1 C66.1 C67.1 C68.1 C69.1 C70.1 C71.1 C72.1 C73.1 C74.1 C75.1 C76.1 C77.1 C78.1 C82.1 C83.1 C84.1 C85.1 C86.1 C90.1 C91.1 C92.1 C93.1 C94.1 C98.1 C99.1 C100.1 C101.1 C102.1 C106.1 C107.1 C108.1 C109.1 C112.1 C113.1 C114.1 C115.1 C116.1 C120.1 C121.1 C122.1 C123.1 C124.1 C128.1 C129.1 C130.1 C131.1 C132.1 C136.1 C137.1 C138.1 C139.2 C140.2 C141.2 C142.2 C143.2 C144.2 C145.2 C146.2 C149.2 C150.1 C151.1 C152.1 C153.1 C154.2 C155.2 C156.1 C157.1 C158.1 C159.1 C160.1 C162.2 C163.2 C165.1 C166.1 CN1.1 CN2.1 D1.2 D4.1 D6.2 D7.1 H1.4 OSC1.2 Q8.2 Q11.4 Q11.7 Q12.4 Q12.7 Q15.4 Q15.7 Q17.4 Q17.7 Q18.4 Q18.7 Q21.4 Q21.7 Q23.4 Q23.7 Q24.4 Q24.7 Q27.4 Q27.7 Q29.4 Q29.7 Q30.4 Q30.7 Q33.4 Q33.7 Q35.4 Q35.7 Q36.4 Q36.7 Q39.4 Q39.7 Q41.4 Q41.7 Q42.4 Q42.7 Q45.4 Q45.7 Q47.4 Q47.7 Q48.4 Q48.7 Q50.4 Q50.7 Q52.4 Q52.7 Q53.4 Q53.7 Q56.4 Q56.7 R9.2 R10.1 R16.1 R21.1 R22.1 R23.1 R24.1 R25.1 R26.1 R27.1 R34.1 R35.1 R36.1 R37.1 R38.1 R39.1 R46.1 R47.1 R48.1 R49.1 R50.1 R51.1 R58.1 R59.1 R60.1 R61.1 R62.1 R63.1 R70.1 R71.1 R72.1 R73.1 R74.1 R75.1 R82.1 R83.1 R84.1 R85.1 R86.1 R87.1 R94.1 R95.1 R96.1 R97.1 R98.1 R99.1 R106.1 R107.1 R108.1 R109.1 R110.1 R111.1 R120.1 R121.1 R122.2 R125.2 R129.1 TP1.1 TP2.1 U1.14 U1.25 U1.51 U1.72 U1.82 U1.93 U1.114 U1.125 U1.149 U1.170 U1.184 U1.202 U2.4 U3.6 U4.8 U4.13 U5.3 U6.3 U7.2 U8.2 U11.4 U11.6 U11.7 U12.4 U12.6 U12.7 U13.1 U13.3 U13.6 U14.1 U14.4 U14.9 U15.3 U16.2 U17.6 U17.25 U18.6 U18.25 U19.6 U19.25 U20.6 U20.25 U21.6 U21.25 U22.6 U22.25 U23.6 U23.25 U24.6 U24.25 U25.3 U25.11 U26.6 U26.7 U26.10 U26.27 U27.57 USB1.1 USB1.2 USB1.3 USB1.4 USB1.A1B12 USB1.B1A12
VBAT1_IN: Q3.4 Q3.7 Q4.1 Q4.2 Q4.5 Q4.6 Q4.8 Q5.1 Q5.2 Q5.5 Q5.6 Q5.8 R13.2 U9.4 U11.2
VBAT2_IN: Q2.4 Q2.7 Q4.4 Q4.7 Q5.4 Q5.7 R14.2 U10.4 U12.2
VBAT_BACKUP: U16.1
VBAT_PRIMARY: C13.1 C28.2 C31.2 C150.2 C151.2 L4.1 Q1.1 Q1.2 Q1.5 Q1.6 Q1.8 Q3.1 Q3.2 Q3.5 Q3.6 Q3.8 Q6.1 Q6.2 Q6.5 Q6.6 Q6.8 Q7.1 Q7.2 Q7.5 Q7.6 Q7.8 Q9.2 Q10.1 Q10.2 Q10.5 Q10.6 Q10.8 Q13.1 Q13.2 Q13.5 Q13.6 Q13.8 Q14.1 Q14.2 Q14.5 Q14.6 Q14.8 Q16.1 Q16.2 Q16.5 Q16.6 Q16.8 Q19.1 Q19.2 Q19.5 Q19.6 Q19.8 Q20.1 Q20.2 Q20.5 Q20.6 Q20.8 Q22.1 Q22.2 Q22.5 Q22.6 Q22.8 Q25.1 Q25.2 Q25.5 Q25.6 Q25.8 Q26.1 Q26.2 Q26.5 Q26.6 Q26.8 Q28.1 Q28.2 Q28.5 Q28.6 Q28.8 Q31.1 Q31.2 Q31.5 Q31.6 Q31.8 Q32.1 Q32.2 Q32.5 Q32.6 Q32.8 Q34.1 Q34.2 Q34.5 Q34.6 Q34.8 Q37.1 Q37.2 Q37.5 Q37.6 Q37.8 Q38.1 Q38.2 Q38.5 Q38.6 Q38.8 Q40.1 Q40.2 Q40.5 Q40.6 Q40.8 Q43.1 Q43.2 Q43.5 Q43.6 Q43.8 Q44.1 Q44.2 Q44.5 Q44.6 Q44.8 Q46.1 Q46.2 Q46.5 Q46.6 Q46.8 Q49.1 Q49.2 Q49.5 Q49.6 Q49.8 Q51.1 Q51.2 Q51.5 Q51.6 Q51.8 Q54.1 Q54.2 Q54.5 Q54.6 Q54.8 Q55.1 Q55.2 Q55.5 Q55.6 Q55.8 R17.1 R127.2 U9.8 U14.2 U14.3 U26.22 U26.23
VBAT_SECONDARY: Q2.1 Q2.2 Q2.5 Q2.6 Q2.8 Q6.4 Q6.7 Q7.4 Q7.7 Q9.3 U10.8
VCC_3V3: C1.2 C3.2 C5.2 C6.2 C7.2 C8.2 C10.1 C17.1 C18.2 C19.2 C21.2 C23.2 C25.2 C26.2 C30.2 C36.2 C38.2 C39.2 C40.2 C41.2 C42.2 C43.2 C44.2 C45.2 C46.2 C47.2 C48.2 C49.2 C50.2 C51.2 C52.2 C53.2 C54.2 C55.2 C56.2 C57.2 C58.2 C59.2 C60.2 C61.2 C62.2 C63.2 C64.2 C65.2 C66.2 C67.2 C68.2 C69.2 C70.2 C72.2 C75.2 C76.2 C140.1 C156.2 C157.2 C158.2 C159.2 C160.2 C161.1 C162.1 C164.1 C165.2 C166.2 H1.1 L1.1 L2.2 OSC1.4 R2.2 R15.2 R118.2 R119.1 R123.2 R126.1 R132.2 R133.2 TP3.1 U1.6 U1.15 U1.26 U1.39 U1.42 U1.52 U1.59 U1.73 U1.83 U1.94 U1.103 U1.115 U1.124 U1.150 U1.158 U1.171 U1.185 U1.204 U2.8 U3.5 U3.8 U4.1 U4.16 U5.5 U6.5 U7.5 U11.5 U12.5 U13.8 U15.2 U25.1 U25.2 U25.9 U27.2 U27.3 U27.20 U27.29 U27.46 U27.55 U27.56
VCC_5V: C24.2 C27.1 C29.1 C32.1 C34.2 C77.2 C78.2 C85.2 C86.2 C93.2 C94.2 C101.2 C102.2 C109.2 C115.2 C116.2 C123.2 C124.2 C131.2 C132.2 L3.2 R1.2 R11.1 U13.2 U14.6 U17.4 U18.4 U19.4 U20.4 U21.4 U22.4 U23.4 U24.4
VCC_VIDEO: C22.1 D1.1
ARM_INHIBIT: U1.164
BAL_CTRL: Q9.1 R17.2 U1.139
BAT1_PAD+: C14.1 CN1.2 R13.1 U11.3
BAT2_PAD+: C9.1 CN2.2 R14.1 U12.3
BUZZER_EN: U1.163
CC1: D4.2 U25.7 USB1.A5
CC2: D4.3 U25.6 USB1.B5
CHARGE_EN: R126.2 U1.140 U26.13
CHG_INT: R118.1 U1.166 U26.21
CHG_STAT: R128.2 U1.165 U26.1
CURRENT_SENSE1: U7.3 U11.8
CURRENT_SENSE2: U12.8
DN: D7.3 USB1.A7 USB1.B7
DP: D7.2 USB1.A6 USB1.B6
DSHOT_M1: U1.43 U17.1 U17.2 U17.3 U17.22 U17.23 U17.24
DSHOT_M2: U1.44 U18.1 U18.2 U18.3 U18.22 U18.23 U18.24
DSHOT_M3: U1.45 U19.1 U19.2 U19.3 U19.22 U19.23 U19.24
DSHOT_M4: U1.50 U20.1 U20.2 U20.3 U20.22 U20.23 U20.24
DSHOT_M5: U1.61 U21.1 U21.2 U21.3 U21.22 U21.23 U21.24
DSHOT_M6: U1.62 U22.1 U22.2 U22.3 U22.22 U22.23 U22.24
DSHOT_M7: U1.81 U23.1 U23.2 U23.3 U23.22 U23.23 U23.24
DSHOT_M8: U1.85 U24.1 U24.2 U24.3 U24.22 U24.23 U24.24
ESP32_ANT: U27.1
ESP32_GPIO1: U27.6
ESP32_GPIO2: U27.7
ESP32_GPIO3: U27.8
ESP32_GPIO4: U27.9
ESP32_GPIO5: U27.10
ESP32_GPIO6: U27.11
ESP32_GPIO7: U27.12
ESP32_GPIO8: U27.13
ESP32_GPIO9: U27.14
ESP32_GPIO10: U27.15
ESP32_GPIO11: U27.16
ESP32_GPIO12: U27.17
ESP32_GPIO13: U27.18
ESP32_GPIO14: U27.19
ESP32_GPIO17: U27.23
ESP32_GPIO18: U27.24
ESP32_GPIO19: U27.25
ESP32_GPIO20: U27.26
ESP32_GPIO21: U27.27
ESP32_GPIO33: U27.38
ESP32_GPIO34: U27.39
ESP32_GPIO35: U27.40
ESP32_GPIO36: U27.41
ESP32_GPIO37: U27.42
ESP32_GPIO38: U27.43
ESP32_GPIO45: U27.51
ESP32_GPIO46: U27.52
I2C1_SCL: R119.2 U1.198 U26.14
I2C1_SDA: R123.1 R130.1 U1.199 U26.15
IMU1_CS: U1.195 U3.12
IMU1_INT: U1.7 U3.4
IMU2_CS: U1.196 U4.5
IMU2_INT: U1.36 U4.6
M1PHAH: R100.2 R108.2 U17.19
M1PHAL: R104.2 R111.2 U17.9
M1PHBH: R101.1 R107.2 U17.16
M1PHBL: R103.1 R110.2 U17.10
M1PHCH: R102.1 R106.2 U17.13
M1PHCL: R105.1 R109.2 U17.11
M2PHAH: R24.2 R113.2 U18.19
M2PHAL: R27.2 R116.2 U18.9
M2PHBH: R23.2 R112.1 U18.16
M2PHBL: R26.2 R115.1 U18.10
M2PHCH: R22.2 R114.1 U18.13
M2PHCL: R25.2 R117.1 U18.11
M3PHAH: R29.2 R36.2 U19.19
M3PHAL: R32.2 R39.2 U19.9
M3PHBH: R28.1 R35.2 U19.16
M3PHBL: R31.1 R38.2 U19.10
M3PHCH: R30.1 R34.2 U19.13
M3PHCL: R33.1 R37.2 U19.11
M4PHAH: R41.2 R48.2 U20.19
M4PHAL: R44.2 R51.2 U20.9
M4PHBH: R40.1 R47.2 U20.16
M4PHBL: R43.1 R50.2 U20.10
M4PHCH: R42.1 R46.2 U20.13
M4PHCL: R45.1 R49.2 U20.11
M5PHAH: R53.2 R60.2 U21.19
M5PHAL: R56.2 R63.2 U21.9
M5PHBH: R52.1 R59.2 U21.16
M5PHBL: R55.1 R62.2 U21.10
M5PHCH: R54.1 R58.2 U21.13
M5PHCL: R57.1 R61.2 U21.11
M6PHAH: R65.2 R72.2 U22.19
M6PHAL: R68.2 R75.2 U22.9
M6PHBH: R64.1 R71.2 U22.16
M6PHBL: R67.1 R74.2 U22.10
M6PHCH: R66.1 R70.2 U22.13
M6PHCL: R69.1 R73.2 U22.11
M7PHAH: R77.2 R84.2 U23.19
M7PHAL: R80.2 R87.2 U23.9
M7PHBH: R76.1 R83.2 U23.16
M7PHBL: R79.1 R86.2 U23.10
M7PHCH: R78.1 R82.2 U23.13
M7PHCL: R81.1 R85.2 U23.11
M8PHAH: R89.2 R96.2 U24.19
M8PHAL: R92.2 R99.2 U24.9
M8PHBH: R88.1 R95.2 U24.16
M8PHBL: R91.1 R98.2 U24.10
M8PHCH: R90.1 R94.2 U24.13
M8PHCL: R93.1 R97.2 U24.11
MOTOR1_A: C79.2 C82.2 NOREF#12.1 Q1.4 Q1.7 Q53.1 Q53.2 Q53.5 Q53.6 Q53.8 U17.18
MOTOR1_B: C80.1 C83.2 NOREF#15.1 Q51.4 Q51.7 Q52.1 Q52.2 Q52.5 Q52.6 Q52.8 U17.15
MOTOR1_C: C81.1 C84.2 NOREF#3.2 Q49.4 Q49.7 Q50.1 Q50.2 Q50.5 Q50.6 Q50.8 U17.12
MOTOR2_A: C87.2 C90.2 NOREF#10.3 Q12.1 Q12.2 Q12.5 Q12.6 Q12.8 Q54.4 Q54.7 U18.18
MOTOR2_B: C88.1 C91.2 NOREF#7.4 Q10.4 Q10.7 Q11.1 Q11.2 Q11.5 Q11.6 Q11.8 U18.15
MOTOR2_C: C89.1 C92.2 NOREF#4.5 Q55.4 Q55.7 Q56.1 Q56.2 Q56.5 Q56.6 Q56.8 U18.12
MOTOR3_A: C95.2 C98.2 NOREF#18.6 Q13.4 Q13.7 Q18.1 Q18.2 Q18.5 Q18.6 Q18.8 U19.18
MOTOR3_B: C96.1 C99.2 NOREF#20.7 Q16.4 Q16.7 Q17.1 Q17.2 Q17.5 Q17.6 Q17.8 U19.15
MOTOR3_C: C97.1 C100.2 NOREF#6.8 Q14.4 Q14.7 Q15.1 Q15.2 Q15.5 Q15.6 Q15.8 U19.12
MOTOR4_A: C103.2 C106.2 NOREF#21.1 Q19.4 Q19.7 Q24.1 Q24.2 Q24.5 Q24.6 Q24.8 U20.18
MOTOR4_B: C104.1 C107.2 NOREF#5.2 Q22.4 Q22.7 Q23.1 Q23.2 Q23.5 Q23.6 Q23.8 U20.15
MOTOR4_C: C105.1 C108.2 NOREF#11.3 Q20.4 Q20.7 Q21.1 Q21.2 Q21.5 Q21.6 Q21.8 U20.12
MOTOR5_A: C110.2 C112.2 NOREF#16.1 Q25.4 Q25.7 Q30.1 Q30.2 Q30.5 Q30.6 Q30.8 U21.18
MOTOR5_B: C111.1 C113.2 NOREF#8.2 Q28.4 Q28.7 Q29.1 Q29.2 Q29.5 Q29.6 Q29.8 U21.15
MOTOR5_C: C37.1 C114.2 NOREF#9.3 Q26.4 Q26.7 Q27.1 Q27.2 Q27.5 Q27.6 Q27.8 U21.12
MOTOR6_A: C117.2 C120.2 NOREF#23.1 Q31.4 Q31.7 Q36.1 Q36.2 Q36.5 Q36.6 Q36.8 U22.18
MOTOR6_B: C118.1 C121.2 NOREF#24.2 Q34.4 Q34.7 Q35.1 Q35.2 Q35.5 Q35.6 Q35.8 U22.15
MOTOR6_C: C119.1 C122.2 NOREF#22.3 Q32.4 Q32.7 Q33.1 Q33.2 Q33.5 Q33.6 Q33.8 U22.12
MOTOR7_A: C125.2 C128.2 NOREF#17.1 Q37.4 Q37.7 Q42.1 Q42.2 Q42.5 Q42.6 Q42.8 U23.18
MOTOR7_B: C126.1 C129.2 NOREF#2.2 Q40.4 Q40.7 Q41.1 Q41.2 Q41.5 Q41.6 Q41.8 U23.15
MOTOR7_C: C127.1 C130.2 NOREF.3 Q38.4 Q38.7 Q39.1 Q39.2 Q39.5 Q39.6 Q39.8 U23.12
MOTOR8_A: C133.2 C136.2 NOREF#13.1 Q43.4 Q43.7 Q48.1 Q48.2 Q48.5 Q48.6 Q48.8 U24.18
MOTOR8_B: C134.1 C137.2 NOREF#14.2 Q46.4 Q46.7 Q47.1 Q47.2 Q47.5 Q47.6 Q47.8 U24.15
MOTOR8_C: C135.1 C138.2 NOREF#19.3 Q44.4 Q44.7 Q45.1 Q45.2 Q45.5 Q45.6 Q45.8 U24.12
PARALLEL_EN: Q6.3 Q7.3 U1.57 U6.2
PD_PG: U1.141 U25.10
PRECHARGE_EN: R18.1 U1.138
QUADSPI_CLK: R6.2 U1.151
QUADSPI_IO0: R5.2 U1.155
QUADSPI_IO1: R3.1 U1.154
QUADSPI_IO2: R4.1 U1.156
QUADSPI_IO3: R7.2 U1.152
QUADSPI_NCS: R8.1 U1.157
REGN: R124.1 R128.1 R130.2 R131.2
SERIES_EN: Q4.3 Q5.3 U1.58 U5.1
SERIES_GATE_EN: R12.1 U5.4
SERIES_INHIBIT: U1.161 U7.1
SPI1_MISO: U1.55 U3.1 U4.4
SPI1_MOSI: U1.56 U3.14 U4.3
SPI1_SCK: U1.54 U3.13 U4.2
STM32_NRST: C15.2 U1.34 U15.1
SW1: C147.2
SW2: C148.1 R122.1 U26.20
SWCLK: H1.3 U1.159
SWDIO: H1.2 U1.147
UART1_RX: U1.144 U27.49
UART1_TX: U1.143 U27.50
UART3_RX: U1.91
UART3_TX: U1.90
USBC-VBUS: D4.4 D7.4 USB1.A4B9 USB1.B4A9
VREF+: C35.2 L1.2 U1.41
VSYS_CHG: C144.1 C145.1 C146.1 C149.1 C154.1 U26.25
WS2812B_DIN: U1.162
$1N47: C4.2 U1.92
$1N50: C71.2 U1.148
$1N62: C73.2 C74.2 U1.137
$1N63: R2.1 U1.203
$1N65: R9.1 U1.197
$1N121: OSC1.3 U1.32
$1N124: R8.2 U2.1
$1N126: R3.2 U2.2
$1N128: R4.2 U2.3
$1N130: R5.1 U2.5
$1N132: R6.1 U2.6
$1N134: R7.1 U2.7
$3N2: C2.1 U4.14
$4N1: C152.2 U26.5
$4N3: R125.1 U26.16
$4N5: C155.1 U26.29
$4N7: L5.1 U26.28
$4N8: L5.2 U26.26
$4N14: C153.2 U26.24
$4N19: C148.2 U26.19
$4N20: R127.1 U26.18
$4N22: R131.1 U26.17
$4N31: R124.2 U26.12
$4N33: R129.2 U26.11
$4N38: C147.1 U26.4
$4N69: R121.2 U25.5
$4N70: R120.2 U25.4
$5N31: R133.1 U27.5
$5N35: C163.1 R132.1 U27.4
$6N20: Q48.3 R92.1
$6N21: Q47.3 R91.2
$6N22: Q45.3 R93.2
$6N33: Q46.3 R88.2
$6N36: Q43.3 R90.2
$6N37: Q44.3 R89.1
$6N42: C135.2 U24.14
$6N44: C134.2 U24.17
$6N46: C133.1 U24.20
$6N74: Q42.3 R80.1
$6N75: Q41.3 R79.2
$6N76: Q39.3 R81.2
$6N87: Q40.3 R76.2
$6N90: Q37.3 R78.2
$6N91: Q38.3 R77.1
$6N96: C127.2 U23.14
$6N98: C126.2 U23.17
$6N100: C125.1 U23.20
$6N128: Q36.3 R68.1
$6N129: Q35.3 R67.2
$6N130: Q33.3 R69.2
$6N141: Q34.3 R64.2
$6N144: Q31.3 R66.2
$6N145: Q32.3 R65.1
$6N150: C119.2 U22.14
$6N152: C118.2 U22.17
$6N154: C117.1 U22.20
$6N182: Q30.3 R56.1
$6N183: Q29.3 R55.2
$6N184: Q27.3 R57.2
$6N195: Q28.3 R52.2
$6N198: Q25.3 R54.2
$6N199: Q26.3 R53.1
$6N204: C37.2 U21.14
$6N206: C111.2 U21.17
$6N208: C110.1 U21.20
$6N236: Q24.3 R44.1
$6N237: Q23.3 R43.2
$6N238: Q21.3 R45.2
$6N249: Q22.3 R40.2
$6N252: Q19.3 R42.2
$6N253: Q20.3 R41.1
$6N258: C105.2 U20.14
$6N260: C104.2 U20.17
$6N262: C103.1 U20.20
$6N290: Q18.3 R32.1
$6N291: Q17.3 R31.2
$6N292: Q15.3 R33.2
$6N303: Q16.3 R28.2
$6N306: Q13.3 R30.2
$6N307: Q14.3 R29.1
$6N312: C97.2 U19.14
$6N314: C96.2 U19.17
$6N316: C95.1 U19.20
$6N344: Q12.3 R116.1
$6N345: Q11.3 R115.2
$6N346: Q56.3 R117.2
$6N357: Q10.3 R112.2
$6N360: Q54.3 R114.2
$6N361: Q55.3 R113.1
$6N366: C89.2 U18.14
$6N368: C88.2 U18.17
$6N370: C87.1 U18.20
$6N398: Q53.3 R104.1
$6N399: Q52.3 R103.2
$6N400: Q50.3 R105.2
$6N411: Q51.3 R101.2
$6N414: Q1.3 R102.2
$6N415: Q49.3 R100.1
$6N420: C81.2 U17.14
$6N422: C80.2 U17.17
$6N424: C79.1 U17.20
$7N3: C22.2 L4.2
$7N4: R10.2 U13.5
$7N12: C33.1 U15.5
$7N15: L3.1 U14.7
$7N19: R1.1 R21.2 U14.5
$7N28: L2.1 U13.7
$7N32: R11.2 U13.4
$8N9: Q8.3 R12.2
$8N15: Q8.1 R16.2 R18.2
$8N22: C20.1 R15.1 U7.4 U8.1
$8N29: U5.2 U6.4
$8N61: C12.2 U10.7
$8N62: C12.1 U10.1
$8N63: C11.2 U9.7
$8N64: C11.1 U9.1
$8N67: Q2.3 R19.2 U10.2
$8N68: R19.1 U10.6
$8N69: Q3.3 R20.2 U9.2
$8N70: R20.1 U9.6

Pads without a net: OSC1 1; U1 1 2 3 4 5 8 9 10 11 12 13 16 17 18 19 20 21 22 23 24 27 28 29 30 31 33 35 37 38 46 47 48 49 53 60 63 64 65 66 67 68 69 70 71 74 75 76 77 78 79 80 84 86 87 88 89 95 96 97 98 99 100 101 102 104 105 106 107 108 109 110 111 112 113 116 117 118 119 120 121 122 123 126 127 128 129 130 131 132 133 134 135 136 142 145 146 153 160 167 168 169 172 173 174 175 176 177 178 179 180 181 182 183 186 187 188 189 190 191 192 193 194 200 201 205 206 207 208; U3 2 3 7 9 10 11; U4 7 9 10 11 12 15; U6 1; U8 3; U9 3 5; U10 3 5; U11 1; U12 1; U14 8; U15 4; U16 3 4; U17 5 7 8 21; U18 5 7 8 21; U19 5 7 8 21; U20 5 7 8 21; U21 5 7 8 21; U22 5 7 8 21; U23 5 7 8 21; U24 5 7 8 21; U27 21 22 28 30 31 32 33 34 35 36 37 44 45 47 48 53 54; USB1 A8 B8

## Via types
v1: diameter 0.61, hole 0.305, Top Layer to Bottom Layer, 370 vias

## Routing (per net, layer and track width the routed paths; a pad name or vN(x,y) marks a point on that pad's centre or on a via; arc(x,y) is an arc through that point)
20V_PD: length 45.3
  Top Layer w0.254: C139.1 19.74,5.4 19.3,5.84 13.35,5.84 v1(12.7,5.19) ; U26.9 9.42,29.29 8.95,29.29 ; v1(5.92,28.54) 6.1,28.71 6.34,28.71 6.5,28.88 6.5,29.27 U26.2 U26.3 ; v1(9.27,12.19) 6.1,12.19 5.82,11.91 5.51,11.91 5.36,12.06 U25.8 ; v1(7.62,27.88) 7.64,27.86 8.52,27.86 8.92,28.26 U26.8
  Inner1 w0.254: v1(5.92,28.54) 6.96,28.54 v1(7.62,27.88) 7.62,13.84 v1(9.27,12.19) 9.27,9.78 12.7,6.35 v1(12.7,5.19)
AGND: length 77.3
  Top Layer w0.254: 39.85,9.97 39.66,9.78 v1(39.66,8.45) C16.2 ; 39.85,9.97 C38.1 ; 39.85,9.97 C26.1 37.43,11.02 37.43,11.88 37.36,11.96 U1.40 ; C164.2 C161.2 58.14,52.17 v1(58.93,52.96) ; C16.2 C16.1 ; C16.2 39.46,6.76 C35.1
  Inner4 w0.254: v1(58.93,52.96) 58.98,52.91 58.98,49.54 59.73,48.79 59.73,16.72 51.57,8.56 39.77,8.56 v1(39.66,8.45)
DGND: length 1172.7
  Top Layer w0.254: 8.25,23.04 7.1,24.19 C140.2 ; 8.25,23.04 8.25,22.48 9.28,21.46 9.28,20.9 9.62,20.56 10.18,20.56 TP1.1 ; 8.25,23.04 10.23,23.04 C60.1 12.25,25.07 C59.1 12.25,27.74 v1(11.81,28.18) 13.11,29.48 U1.184 ; v1(43.39,13.34) 43.39,13.66 43.78,14.05 43.78,16.51 43.53,16.76 43.18,16.76 42.86,16.43 U1.51 42.86,14.15 42.38,13.68 41.43,13.68 41.26,13.51 41.26,11.19 41.6,10.86 43.96,10.86 C45.1 ; C57.1 11.07,14.65 C58.1 10.01,16.76 6.6,16.76 ; C57.1 12.06,13.66 12.06,12.6 12.71,11.95 C36.1 ; C57.1 11.87,13.71 9.53,11.38 ; C56.1 50.28,39.67 C53.1 50.28,39.07 C54.1 ; R125.2 3.63,37.15 3.45,37.33 3.45,38.1 3.61,38.27 4.16,38.27 4.28,38.39 4.36,38.39 4.53,38.55 4.53,38.64 R122.2 4.83,39.99 5.23,40.39 ; C25.1 31.02,7.43 TP2.1 32.13,8.54 C15.1 ; C25.1 26.08,10.3 C40.1 24.05,10.3 C39.1 22.99,10.48 ; C25.1 28.96,6.12 C21.1 ; C143.2 14.35,4.06 ; 14.35,4.06 14.44,4.15 C21.1 ; 14.35,4.06 14.18,3.89 ; C21.1 27.71,3.42 28.9,3.42 29.28,3.8 U15.3 31.64,3.8 32.21,4.38 33.45,4.38 34.02,3.8 35.23,3.8 C33.2 42.55,4.57 42.55,5.03 U4.13 43.29,5.77 43.63,5.77 43.79,5.93 43.79,6.27 44.05,6.53 U4.8 ; U14.4 30.25,52.24 30.25,51.74 30.55,51.44 30.55,51.35 30.72,51.19 30.8,51.19 32,49.99 C68.1 ; U14.4 29.97,52.8 30.23,53.06 30.23,53.14 U14.9 30.23,53.96 30.23,54.04 30.07,54.21 29.99,54.21 29.89,54.3 U14.1 29.69,55.92 C24.1 29.75,57.75 C32.2 29.13,58.44 D1.2 ; U14.4 29.51,52.63 28.27,52.63 27.67,52.02 C28.1 ; TP1.1 11.76,20.45 R9.2 12.19,20.27 12.19,20.19 12.35,20.02 13.15,20.02 13.6,20.48 U1.202 ; TP1.1 6.6,16.76 ; C62.1 12,34.39 C61.1 12,37.08 ; v1(45.57,46.99) 45.57,47.84 C158.1 ; U1.14 24.36,13.6 23.15,12.39 23.15,11.34 22.99,11.18 22.99,10.48 22.99,10.48 ; C68.1 33.23,49.39 C69.1 35.1,48.64 C70.1 ; C68.1 31.45,48.83 C67.1 ; C65.1 18.11,58.11 C66.1 22.76,58.4 D1.2 ; C65.1 14.42,56.01 C75.1 ; C65.1 16.08,58.55 v1(15.24,58.55) ; U1.25 29.86,13.42 OSC1.2 31.4,11.69 31.4,11.11 32.13,10.38 C15.1 ; 53.34,15.99 52.15,14.8 48.75,14.8 48.47,15.08 C8.1 ; 53.34,15.99 C48.1 50.53,20.45 C47.1 50.27,23.59 C49.1 49.69,24 48.96,23.27 47.85,23.27 46.3,24.82 46.3,26.65 45.97,26.98 U1.72 ; 53.34,15.99 56.01,13.32 C13.2 ; U1.170 15.95,36.56 15.16,36.56 14.64,37.08 12,37.08 ; C140.2 5.41,24.53 C152.1 ; C140.2 4.7,24.19 4.18,23.67 v1(3.62,23.67) R120.1 2.87,23.62 R121.1 1.32,23.86 1.32,27.06 1.84,27.58 C155.2 ; USB1.1 2.96,5.72 USB1.A1B12 ; C13.2 52.43,9.46 C5.1 ; C13.2 57.66,11.39 C14.2 ; D1.2 22.79,56.64 C71.1 17.52,54.17 C76.1 ; U26.10 9.47,30.24 9.4,30.17 9.01,30.17 8.54,29.71 8.54,29.63 v1(8.3,29.38) ; 4.31,11.11 5.36,11.11 5.81,11.56 9.36,11.56 9.53,11.38 ; C15.1 33.74,10.22 C44.1 34.08,9.97 C43.1 ; 9.53,11.38 9.53,9.79 9,9.25 9,8.91 9.91,8 9.91,6.26 9.71,6.06 ; U1.114 38.86,46.36 C70.1 ; C70.1 35.83,50.48 39.26,53.9 U16.2 ; 12,37.08 C63.1 ; C52.1 52.25,31.25 C10.2 52.64,29.38 52.97,29.05 52.97,28.47 U11.7 U11.6 53.79,23.73 54.27,23.25 54.27,22.67 U11.4 ; C52.1 50.31,29.55 C51.1 49.98,26.08 C50.1 ; C52.1 49.98,31.58 C4.1 50.28,35.35 50.28,36.96 50.05,36.96 49.54,36.45 47.56,36.45 47.5,36.51 47.46,36.51 47.29,36.67 47.29,37.42 47.15,37.56 45.27,37.56 U1.93 ; U1.125 33.28,44.89 33.28,45.67 32.55,46.4 31.21,46.4 31.13,46.48 30.35,46.48 30.08,46.75 29.53,46.75 29.37,46.92 29.37,47.95 30.1,48.68 C67.1 ; U13.3 54.77,38.86 54.77,38.33 54.69,38.4 53.93,38.4 53.42,38.92 53.42,40.41 54.3,41.29 C162.2 52.93,43.18 C55.1 ; 6.6,16.76 U25.11 U25.3 ; C149.2 C154.2 10.94,44.36 12.19,45.61 12.57,45.61 12.91,45.96 12.91,46.34 13.59,47.02 ; C149.2 C146.2 C145.2 4.51,44.33 C144.2 2.47,44.1 1.52,43.15 1.52,41.51 1.68,41.34 2.46,41.34 3.03,40.77 3.03,40.7 C153.1 5.23,40.39 ; C149.2 6.98,46.09 H1.4 5.21,58.8 v1(5.08,58.67) ; 5.23,40.39 5.8,40.96 7.44,40.96 8.01,40.39 8.24,40.39 C150.1 10.67,40 C64.1 11.24,39.44 C63.1 ; C63.1 8.7,37.85 C151.1 ; v1(6.87,31.28) 6.62,31.28 6.58,31.24 U26.27 ; 46.6,56.19 48.42,56.19 C157.1 50.32,56.53 C166.1 52.45,56.07 C165.1 55.65,56.41 56.38,55.69 56.38,57.26 56.64,57.53 ; 22.99,10.48 21.42,10.48 C42.1 20.53,11.36 C41.1 17.17,11.36 C72.1 16.47,12.06 15.54,12.06 15.36,11.89 15.36,11.81 ; U1.82 43.04,31.98 v1(42.46,32.56) ; C67.1 26.92,48.83 C74.1 26.01,48.68 C73.1 24.71,48.37 24.49,48.37 23.62,47.5 23.26,47.5 21.44,45.67 21.44,44.89 U1.149 ; C5.1 51.44,8.45 51.44,7.75 49.31,5.62 48.82,5.62 48.82,4.02 C6.1 46.67,3.04 C3.1 44.01,3.04 C2.2 ; C5.1 50.42,9.52 49.69,10.24 48.62,10.24 ; v1(59.56,49.78) 59.56,48.89 C160.1 ; U13.6 54.77,37.7 54.77,38 54.93,38.16 55.22,38.16 55.67,38.61 U13.1 56.71,38.96 C30.1 57.75,40 58.29,40 58.77,39.53 C23.1 59.05,40.95 C27.2 58.59,43.15 C29.2 58.49,43.4 C159.1 ; USB1.B1A12 10.51,5.72 USB1.2
  Inner1 w0.254: v1(51.2,38.05) 49.98,38.05 v1(49.92,37.99) ; USB1.2 USB1.4 USB1.3 USB1.1
  Inner1 w0.3: v1(59.56,49.78) 59.56,56.43 CN1.1
  Inner2 w0.254: v1(5.08,58.67) 5.21,58.55 7.65,58.55 8.98,57.21 ; 51.52,49.24 56.77,54.49 v1(56.77,57.53) 55.75,58.55 v1(15.24,58.55) 13.91,57.21 8.98,57.21 ; 8.98,57.21 9.91,56.29 9.91,30.99 v1(8.3,29.38) ; 49.52,47.24 49.26,46.99 v1(45.57,46.99)
  Inner4 w0.254: 20.32,55.24 v1(23.62,55.24) 26.77,55.24 v1(27.38,54.63) ; 20.32,55.24 v1(20.19,55.37) ; 20.32,55.24 20.95,54.61 v1(20.95,48.64) ; 34.24,53.4 34.61,53.77 42.34,53.77 42.96,53.15 43.74,53.15 43.82,53.22 ; 34.24,53.4 34.24,55.22 v1(33.74,55.72) ; 34.24,53.4 28.21,53.4 ; v1(27.38,54.63) 27.79,54.63 28,54.43 28,53.62 28.21,53.4 ; v1(27.38,54.63) 28.53,55.79 v1(28.53,58.18) ; 28.21,53.4 28.21,46.95 ; 28.21,46.95 28.21,40.69 v1(29.7,39.2) ; 28.21,46.95 28.14,47.02 v1(24.73,47.02) ; 19.69,37.11 v1(21.13,35.67) 23.62,33.18 v1(23.62,32.64) 24.14,32.64 v1(27.38,35.88) 29.7,38.2 v1(29.7,39.2) ; 19.69,37.11 19.69,36.58 v1(17.65,34.54) 13.7,34.54 v1(13.08,35.16) 13.08,29.16 v1(14.72,27.52) 15.43,26.81 ; 19.69,37.11 v1(19.69,37.3) 19.69,39.87 v1(19.83,40.02) ; v1(47.63,57.91) 46.8,57.91 v1(43.82,54.93) 43.82,53.22 ; 51.2,37.99 57.2,37.99 v1(58.08,38.87) 58.08,37.03 v1(57.68,36.63) 57.59,36.54 v1(53.92,36.54) v1(53.92,33.49) 55.14,32.27 v1(55.14,30.19) ; v1(49.92,37.99) 49.92,37.6 46.6,34.28 46.54,34.28 v1(46.51,34.25) 44.82,32.56 v1(42.46,32.56) 40.64,34.38 v1(40.64,36.58) 37.84,39.37 v1(37.3,39.37) 37.3,38 v1(35.56,36.26) 32.62,39.2 v1(29.7,39.2) ; v1(52.04,30.53) 54.81,30.53 v1(55.14,30.19) ; v1(55.14,30.19) 55.14,27.15 v1(55.25,27.05) 55.83,26.47 v1(55.83,16.15) 55.83,14.82 v1(54.05,13.05) 53.58,12.58 v1(50.8,12.58) 48.33,10.11 v1(47.45,10.11) ; 45.91,47.43 48.66,47.43 49.47,48.24 ; v1(19.94,19.22) 19.33,19.83 19.33,21.73 v1(17.28,19.69) 14.71,17.12 v1(13.06,17.12) 16.65,13.52 v1(16.65,9.82) 20.05,9.82 v1(20.07,9.84) ; v1(47.45,10.11) 47.45,15.57 v1(46.77,16.25) ; v1(47.45,10.11) 44.22,13.34 v1(43.39,13.34) 40.34,13.34 39.03,12.03 38.15,12.03 v1(34.65,8.52) 34.65,10.75 v1(31.18,14.22) 31.18,17.59 28.58,20.19 v1(28.58,20.99) 30.3,20.99 v1(32.31,18.98) 34.87,18.98 v1(35.12,19.22) 35.12,20 34.16,20.95 v1(34.16,22.61) 32.2,24.57 v1(32.2,27.61) ; 57.83,56.47 v1(56.77,57.53) 52.47,53.24 51.79,53.24 51.27,52.72 50.07,52.72 ; 43.82,53.22 43.82,53.15 44.06,53.15 44.22,53.31 46.77,53.31 ; 50.04,52.57 50.04,49.86 49.43,49.24 ; 45.93,47.41 45.28,46.76 40.02,46.76 v1(39.67,46.41) ; 18.56,26.81 15.43,26.81 19.33,22.91 v1(19.33,22.5) 19.33,21.74 19.33,21.74 ; 50.07,52.72 50.07,53.49 49.61,53.95 47.42,53.95 46.77,53.3 ; 50.07,52.72 50.07,52.7 ; v1(45.57,46.99) 45.82,46.99
  Bottom Layer w0.2: R25.1 36.75,9.49 36.96,9.28 36.96,9.05 37.28,8.73 ; 37.28,8.73 36.86,8.73 36.63,8.49 36.17,8.49 35.84,8.82 35.84,10 C92.1 ; 37.28,8.73 37.48,8.73 38.11,8.1
  Bottom Layer w0.254: Q45.7 Q45.4 21.15,55.37 v1(20.19,55.37) ; v1(40.64,36.58) 40.39,36.32 C112.1 ; R46.1 16.53,35.67 v1(17.65,34.54) ; v1(34.16,22.61) 34.16,21.71 34.14,21.69 34.18,21.64 34.73,21.64 ; v1(13.06,17.12) 13.33,17.12 13.37,17.15 13.37,16.27 ; C86.1 40.04,11.79 39.72,11.47 39.72,11.39 39.55,11.23 39.47,11.23 39.17,10.92 40.25,9.84 40.25,8.21 39.8,7.76 38.45,7.76 38.11,8.1 38.11,10.88 R26.1 ; C86.1 41.02,14.9 41.02,18.64 40.29,19.37 C85.1 ; C86.1 39.97,13.99 U18.6 37.63,13.99 U18.25 ; R98.1 22.25,49.1 22.25,51.68 C138.1 ; R98.1 R99.1 ; R98.1 21.79,48.64 v1(20.95,48.64) ; 25.2,46.78 24.96,47.02 v1(24.73,47.02) ; v1(15.24,58.55) 15.24,57.78 14.99,57.52 10.95,57.52 10.95,53.24 U12.7 U12.6 10.13,53.64 9.54,54.23 9.42,54.23 7.08,51.89 7.08,50.41 7.81,49.68 C17.2 ; Q47.7 27.91,58.18 v1(28.53,58.18) ; Q48.7 Q48.4 30.77,46.84 C131.1 ; 43.14,32.37 43.14,32.98 42.87,32.98 v1(42.46,32.56) R60.1 ; 14.26,35.16 14.24,35.15 13.12,35.15 ; C78.1 24.53,13.83 U17.6 22.99,13.91 22.63,13.91 22.46,14.08 22.46,14.44 21.83,15.08 U17.25 ; C78.1 24.57,14.01 25.52,14.97 25.52,16.61 24.57,17.56 24.57,18.29 C77.1 ; C78.1 24.77,13.59 24.77,10.79 24.59,10.62 R111.1 23.98,10.64 R110.1 23.06,10.36 23.06,9.16 22.72,8.81 22.24,8.81 21.89,9.16 ; 55.08,27.72 55.25,27.55 v1(55.25,27.05) ; Q8.2 10.46,39.54 10.46,42.76 9.89,43.32 9.09,43.32 8.92,43.49 8.92,44.52 9.09,44.68 9.65,44.68 9.65,44.9 ; v1(55.83,16.15) 55.83,17.22 R37.1 55.51,17.7 R38.1 55.5,18.87 R39.1 55.2,20.37 55.2,20.45 54.37,21.28 C94.1 ; U22.25 49.2,34.25 48.91,34.25 48.32,34.84 47.43,34.84 46.84,34.25 v1(46.51,34.25) 46.51,34.22 45.65,33.37 45.65,32.34 45.81,32.17 46.06,32.17 47.2,31.03 47.2,29.19 48.16,28.24 C116.1 ; 23.62,54.41 v1(23.62,55.24) ; C122.1 58.08,39 v1(58.08,38.87) ; R51.1 14.97,28.22 14.72,27.97 v1(14.72,27.52) ; R58.1 31.05,34.28 C114.1 32.21,31.74 R61.1 R62.1 32.21,29.08 32.2,29.08 v1(32.2,27.61) 32.26,27.56 34.97,27.56 C34.1 ; 9.38,30.94 9.11,31.21 6.24,31.21 6.06,31.03 ; 9.38,30.94 9.46,31.03 ; 9.38,30.94 10.53,29.79 10.53,28.56 10.69,28.39 11.52,28.39 12.27,29.14 12.27,32.37 11.47,33.17 9.79,33.17 9.4,33.56 9.4,35.36 9.33,35.43 9.33,35.79 R16.1 ; v1(31.18,14.22) 31.18,15.1 R23.1 ; 6.06,31.03 4.02,31.03 C18.1 ; 6.06,31.03 5.65,30.62 5.65,29.77 5.31,29.77 3.75,28.21 3.75,27.86 3.14,27.25 U8.2 ; R106.1 19.19,10.71 v1(20.07,9.84) 20.39,9.51 20.39,9.27 20.73,8.92 21.21,8.92 21.45,9.16 21.89,9.16 ; 21.89,9.16 21.89,9.64 22,9.75 22,10.22 R109.1 ; Q17.7 48.32,10.11 v1(47.45,10.11) ; v1(56.77,57.53) 55.44,56.2 C128.1 ; 57.06,36.61 57.07,36.63 v1(57.68,36.63) ; C101.1 22.54,26.8 18.16,26.8 18.02,26.94 C102.1 18.13,28.05 18.13,29.54 18.21,29.62 18.21,29.99 18.38,30.15 18.74,30.15 19.38,30.79 U20.25 ; v1(54.05,13.05) 54.96,13.05 Q15.4 Q15.7 ; C106.1 27.41,35.88 v1(27.38,35.88) 26.71,35.21 Q24.4 Q24.7 ; R83.1 44.69,54.93 v1(43.82,54.93) ; v1(11.81,28.18) 10.81,28.18 9.99,27.35 9.74,27.35 9.57,27.18 9.57,26.94 U6.3 ; C20.2 3.19,21.13 U7.2 3.37,22.77 3.37,23.02 3.62,23.27 v1(3.62,23.67) ; Q23.7 18.77,40.02 v1(19.83,40.02) ; 47.24,57.09 46.36,57.09 47.12,57.85 47.62,57.85 ; Q50.7 16.65,10.45 v1(16.65,9.82) ; 18.45,22.42 18.53,22.5 v1(19.33,22.5) ; 14.95,29.96 R50.1 R49.1 14.62,31.43 C108.1 ; v1(43.39,13.34) 44.06,13.34 Q18.4 Q18.7 ; 14.13,29.66 14.65,29.66 14.9,29.91 ; R84.1 48.17,49.7 47.88,49.42 47.88,47.93 48.05,47.77 49,47.77 49.52,47.24 ; U21.25 36.7,30.81 35.92,30.02 35.7,30.02 35.54,29.86 35.54,29.64 35.31,29.41 35.31,27.89 C34.1 ; 34.61,9.51 34.61,8.48 34,7.87 31.62,7.87 30.26,9.24 Q56.7 Q56.4 ; 34.61,9.51 33.59,10.52 ; 34.61,9.51 34.61,9.77 C92.1 ; C94.1 51.14,22.24 49.14,22.24 49.04,22.14 47.51,22.14 46.78,21.41 C93.1 ; C94.1 52.17,21.2 U19.6 52.17,18.99 U19.25 ; R75.1 49.8,38.11 v1(49.92,37.99) 49.92,38.09 R74.1 49.94,38.46 49.84,38.55 49.84,40.21 50.01,40.38 50.87,40.38 51.06,40.57 51.06,41.45 ; R35.1 49.93,12.58 v1(50.8,12.58) ; C34.1 36.62,26.42 40.13,26.42 40.83,27.12 C109.1 ; Q42.7 49.23,52.72 v1(49.98,52.72) ; v1(35.56,36.26) 36.59,36.26 R59.1 ; R95.1 27.71,54.63 v1(27.38,54.63) 26.7,55.31 C137.1 ; v1(33.74,55.72) 31.98,53.95 C136.1 31.98,52.33 R96.1 ; C82.1 17.02,19.62 17.02,16.69 R107.1 16.71,15.63 C83.1 ; Q27.7 29.7,38.45 v1(29.7,39.2) ; C130.1 39.37,50.23 39.37,46.7 v1(39.67,46.41) ; v1(28.58,20.99) 28.58,20.14 28.71,20.02 28.71,19.67 ; 38.08,55.46 v1(38.08,54.58) ; U12.4 9.48,45.07 ; v1(45.57,46.99) 47.02,46.99 C123.1 47.8,45.77 47.25,45.22 43.45,45.22 42.49,46.17 C124.1 42.36,46.26 U23.6 42.44,47.93 42.44,48.3 42.6,48.46 42.97,48.46 43.61,49.1 U23.25
  Bottom Layer w0.3: CN2.1 4.32,49.44 5.11,49.44 5.71,48.83 5.71,48.7 6.45,47.96 6.59,47.96 9.65,44.9 ; 25.74,48.97 26.52,49.76 26.59,49.76
  Bottom Layer w0.4: U24.6 25.76,47.34 C132.1 24.65,46.1 25.68,45.07 28.96,45.07 29.98,46.1 C131.1
  vias: v1(14.16,29.65) v1(18.51,26.81) v1(40.49,53.86) v1(54.51,38.28)
